# Altium project Y001_Artix7_USB3.0_D0.PrjPCB (part 1 of 2)
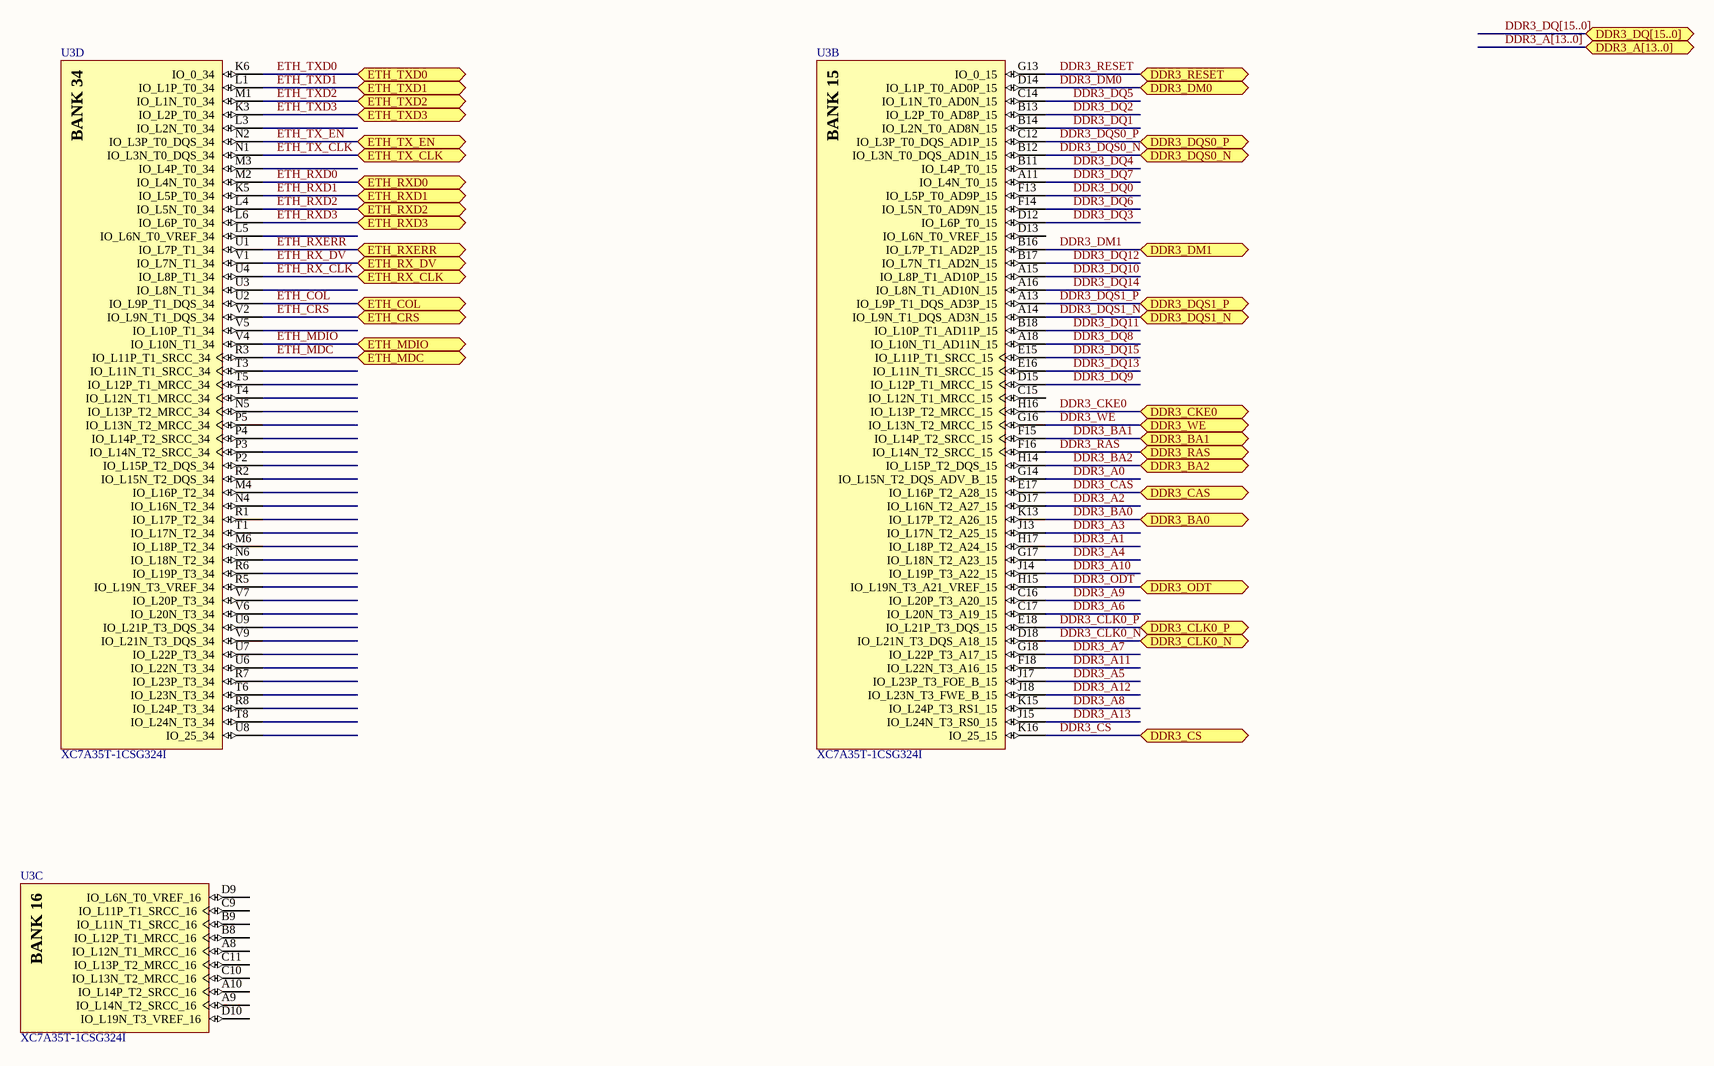
[diagram p0: FPGA_Bank_0.SchDoc]
9 sheets, 325 parts. Net scope: flat (ports and power ports of the same name join across sheets).
Board file: Y001_Artix7_USB3.0_D0.PcbDoc
Sheets:
  FPGA_Bank_0.SchDoc
  FPGA_Bank_1.SchDoc
  FPGA_Bank_2.SchDoc
  FPGA_Bank_3.SchDoc
  FPGA_10_100 Ethernet PHY.SchDoc
  DDR3.SchDoc
  USB3.0.SchDoc
  POWER.SchDoc
  POWER2.SchDoc

## Sheet FPGA_Bank_0.SchDoc
size A3

### Parts
U3  XC7A35T-1CSG324I  [CSG324]  (parts B,C,D of 9)

### Ports
DDR3_A[13..0], DDR3_BA0, DDR3_BA1, DDR3_BA2, DDR3_CAS, DDR3_CKE0, DDR3_CLK0_N, DDR3_CLK0_P, DDR3_CS, DDR3_DM0, DDR3_DM1, DDR3_DQ[15..0], DDR3_DQS0_N, DDR3_DQS0_P, DDR3_DQS1_N, DDR3_DQS1_P, DDR3_ODT, DDR3_RAS, DDR3_RESET, DDR3_WE, ETH_COL, ETH_CRS, ETH_MDC, ETH_MDIO, ETH_RX_CLK, ETH_RX_DV, ETH_RXD0, ETH_RXD1, ETH_RXD2, ETH_RXD3, ETH_RXERR, ETH_TX_CLK, ETH_TX_EN, ETH_TXD0, ETH_TXD1, ETH_TXD2, ETH_TXD3

### Nets
DDR3_A0: U3.G14(IO_L15N_T2_DQS_ADV_B_15)
DDR3_A1: U3.H17(IO_L18P_T2_A24_15)
DDR3_A2: U3.D17(IO_L16N_T2_A27_15)
DDR3_A3: U3.J13(IO_L17N_T2_A25_15)
DDR3_A4: U3.G17(IO_L18N_T2_A23_15)
DDR3_A5: U3.J17(IO_L23P_T3_FOE_B_15)
DDR3_A6: U3.C17(IO_L20N_T3_A19_15)
DDR3_A7: U3.G18(IO_L22P_T3_A17_15)
DDR3_A8: U3.K15(IO_L24P_T3_RS1_15)
DDR3_A9: U3.C16(IO_L20P_T3_A20_15)
DDR3_A10: U3.J14(IO_L19P_T3_A22_15)
DDR3_A11: U3.F18(IO_L22N_T3_A16_15)
DDR3_A12: U3.J18(IO_L23N_T3_FWE_B_15)
DDR3_A13: U3.J15(IO_L24N_T3_RS0_15)
DDR3_BA0: U3.K13(IO_L17P_T2_A26_15) ; port DDR3_BA0
DDR3_BA1: U3.F15(IO_L14P_T2_SRCC_15) ; port DDR3_BA1
DDR3_BA2: U3.H14(IO_L15P_T2_DQS_15) ; port DDR3_BA2
DDR3_CAS: U3.E17(IO_L16P_T2_A28_15) ; port DDR3_CAS
DDR3_CKE0: U3.H16(IO_L13P_T2_MRCC_15) ; port DDR3_CKE0
DDR3_CLK0_N: U3.D18(IO_L21N_T3_DQS_A18_15) ; port DDR3_CLK0_N
DDR3_CLK0_P: U3.E18(IO_L21P_T3_DQS_15) ; port DDR3_CLK0_P
DDR3_CS: U3.K16(IO_25_15) ; port DDR3_CS
DDR3_DM0: U3.D14(IO_L1P_T0_AD0P_15) ; port DDR3_DM0
DDR3_DM1: U3.B16(IO_L7P_T1_AD2P_15) ; port DDR3_DM1
DDR3_DQ0: U3.F13(IO_L5P_T0_AD9P_15)
DDR3_DQ1: U3.B14(IO_L2N_T0_AD8N_15)
DDR3_DQ2: U3.B13(IO_L2P_T0_AD8P_15)
DDR3_DQ3: U3.D12(IO_L6P_T0_15)
DDR3_DQ4: U3.B11(IO_L4P_T0_15)
DDR3_DQ5: U3.C14(IO_L1N_T0_AD0N_15)
DDR3_DQ6: U3.F14(IO_L5N_T0_AD9N_15)
DDR3_DQ7: U3.A11(IO_L4N_T0_15)
DDR3_DQ8: U3.A18(IO_L10N_T1_AD11N_15)
DDR3_DQ9: U3.D15(IO_L12P_T1_MRCC_15)
DDR3_DQ10: U3.A15(IO_L8P_T1_AD10P_15)
DDR3_DQ11: U3.B18(IO_L10P_T1_AD11P_15)
DDR3_DQ12: U3.B17(IO_L7N_T1_AD2N_15)
DDR3_DQ13: U3.E16(IO_L11N_T1_SRCC_15)
DDR3_DQ14: U3.A16(IO_L8N_T1_AD10N_15)
DDR3_DQ15: U3.E15(IO_L11P_T1_SRCC_15)
DDR3_DQS0_N: U3.B12(IO_L3N_T0_DQS_AD1N_15) ; port DDR3_DQS0_N
DDR3_DQS0_P: U3.C12(IO_L3P_T0_DQS_AD1P_15) ; port DDR3_DQS0_P
DDR3_DQS1_N: U3.A14(IO_L9N_T1_DQS_AD3N_15) ; port DDR3_DQS1_N
DDR3_DQS1_P: U3.A13(IO_L9P_T1_DQS_AD3P_15) ; port DDR3_DQS1_P
DDR3_ODT: U3.H15(IO_L19N_T3_A21_VREF_15) ; port DDR3_ODT
DDR3_RAS: U3.F16(IO_L14N_T2_SRCC_15) ; port DDR3_RAS
DDR3_RESET: U3.G13(IO_0_15) ; port DDR3_RESET
DDR3_WE: U3.G16(IO_L13N_T2_MRCC_15) ; port DDR3_WE
ETH_COL: U3.U2(IO_L9P_T1_DQS_34) ; port ETH_COL
ETH_CRS: U3.V2(IO_L9N_T1_DQS_34) ; port ETH_CRS
ETH_MDC: U3.R3(IO_L11P_T1_SRCC_34) ; port ETH_MDC
ETH_MDIO: U3.V4(IO_L10N_T1_34) ; port ETH_MDIO
ETH_RX_CLK: U3.U4(IO_L8P_T1_34) ; port ETH_RX_CLK
ETH_RX_DV: U3.V1(IO_L7N_T1_34) ; port ETH_RX_DV
ETH_RXD0: U3.M2(IO_L4N_T0_34) ; port ETH_RXD0
ETH_RXD1: U3.K5(IO_L5P_T0_34) ; port ETH_RXD1
ETH_RXD2: U3.L4(IO_L5N_T0_34) ; port ETH_RXD2
ETH_RXD3: U3.L6(IO_L6P_T0_34) ; port ETH_RXD3
ETH_RXERR: U3.U1(IO_L7P_T1_34) ; port ETH_RXERR
ETH_TX_CLK: U3.N1(IO_L3N_T0_DQS_34) ; port ETH_TX_CLK
ETH_TX_EN: U3.N2(IO_L3P_T0_DQS_34) ; port ETH_TX_EN
ETH_TXD0: U3.K6(IO_0_34) ; port ETH_TXD0
ETH_TXD1: U3.L1(IO_L1P_T0_34) ; port ETH_TXD1
ETH_TXD2: U3.M1(IO_L1N_T0_34) ; port ETH_TXD2
ETH_TXD3: U3.K3(IO_L2P_T0_34) ; port ETH_TXD3

Not connected (* = marked no-connect by the designer): U3 A8(IO_L12N_T1_MRCC_16) A9(IO_L14N_T2_SRCC_16) A10(IO_L14P_T2_SRCC_16) B8(IO_L12P_T1_MRCC_16) B9(IO_L11N_T1_SRCC_16) C9(IO_L11P_T1_SRCC_16) C10(IO_L13N_T2_MRCC_16) C11(IO_L13P_T2_MRCC_16) C15(IO_L12N_T1_MRCC_15) D9(IO_L6N_T0_VREF_16) D10(IO_L19N_T3_VREF_16) D13(IO_L6N_T0_VREF_15) L3(IO_L2N_T0_34) L5(IO_L6N_T0_VREF_34) M3(IO_L4P_T0_34) M4(IO_L16P_T2_34) M6(IO_L18P_T2_34) N4(IO_L16N_T2_34) N5(IO_L13P_T2_MRCC_34) N6(IO_L18N_T2_34) P2(IO_L15P_T2_DQS_34) P3(IO_L14N_T2_SRCC_34) P4(IO_L14P_T2_SRCC_34) P5(IO_L13N_T2_MRCC_34) R1(IO_L17P_T2_34) R2(IO_L15N_T2_DQS_34) R5(IO_L19N_T3_VREF_34) R6(IO_L19P_T3_34) R7(IO_L23P_T3_34) R8(IO_L24P_T3_34) T1(IO_L17N_T2_34) T3(IO_L11N_T1_SRCC_34) T4(IO_L12N_T1_MRCC_34) T5(IO_L12P_T1_MRCC_34) T6(IO_L23N_T3_34) T8(IO_L24N_T3_34) U3(IO_L8N_T1_34) U6(IO_L22N_T3_34) U7(IO_L22P_T3_34) U8(IO_25_34) U9(IO_L21P_T3_DQS_34) V5(IO_L10P_T1_34) V6(IO_L20N_T3_34) V7(IO_L20P_T3_34) V9(IO_L21N_T3_DQS_34)

### Buses and harness runs
bus DDR3_A[13..0] = port DDR3_A[13..0]
bus DDR3_DQ[15..0] = port DDR3_DQ[15..0]

### Notes on the sheet
- (in symbol XC7A35T-1CSG324I, part B) BANK 15
- (in symbol XC7A35T-1CSG324I, part C) BANK 16
- (in symbol XC7A35T-1CSG324I, part D) BANK 34

### Library data of the parts
U3 = XC7A35T-1CSG324I: Artix-7 FPGA, 210 User I/Os, 0 GTP, 324-Ball BGA, Speed Grade 1, Industrial Grade, Pb-Free; Manufacturer: Xilinx; Total Block RAM: 1800 Kb; GTP: 0; Clock Mgmt Tiles (CMTs): 5; Logic Cells: 33280; Available User I/O: 210; Speed Grades: 1; DatasheetVersion: v1.15; PackageVersion: Rev. 1.11; PackageReference: CSG-324; PackageDescription: 324-Ball Wire-Bond Chip-Scale BGA, Body 15 x 15 mm, Pitch 0.8 mm; Maximum Distributed RAM: 400 Kb; Operating Temperature Range: Industrial; NexusDeviceID: XC7A35T-1CSG324I; Mounting Technology: Surface Mount; PartNumber: XC7A35T-1CSG324I; ComponentLink1Description: Manufacturer URL; ComponentLink1URL: http://www.xilinx.com/; ComponentLink2Description: Datasheet; ComponentLink2URL: http://www.xilinx.com/support/documentation/data_sheets/ds180_7Series_Overview.pdf; ComponentLink3Description: Package Specification; ComponentLink3URL: http://www.xilinx.com/support/documentation/user_guides/ug475_7Series_Pkg_Pinout.pdf; ComponentLink4Description: DC and Switching Characteristics; ComponentLink4URL: http://www.xilinx.com/support/documentation/data_sheets/ds181_Artix_7_Data_Sheet.pdf; ComponentLink5Description: Package File; ComponentLink5URL: http://www.xilinx.com/support/packagefiles/a7packages/xc7a200tsbg484pkg.txt; ComponentLink6Description: Packaging and Pinout; ComponentLink6URL: http://www.xilinx.com/support/documentation/user_guides/ug475_7Series_Pkg_Pinout.pdf

## Sheet FPGA_Bank_1.SchDoc
size A3
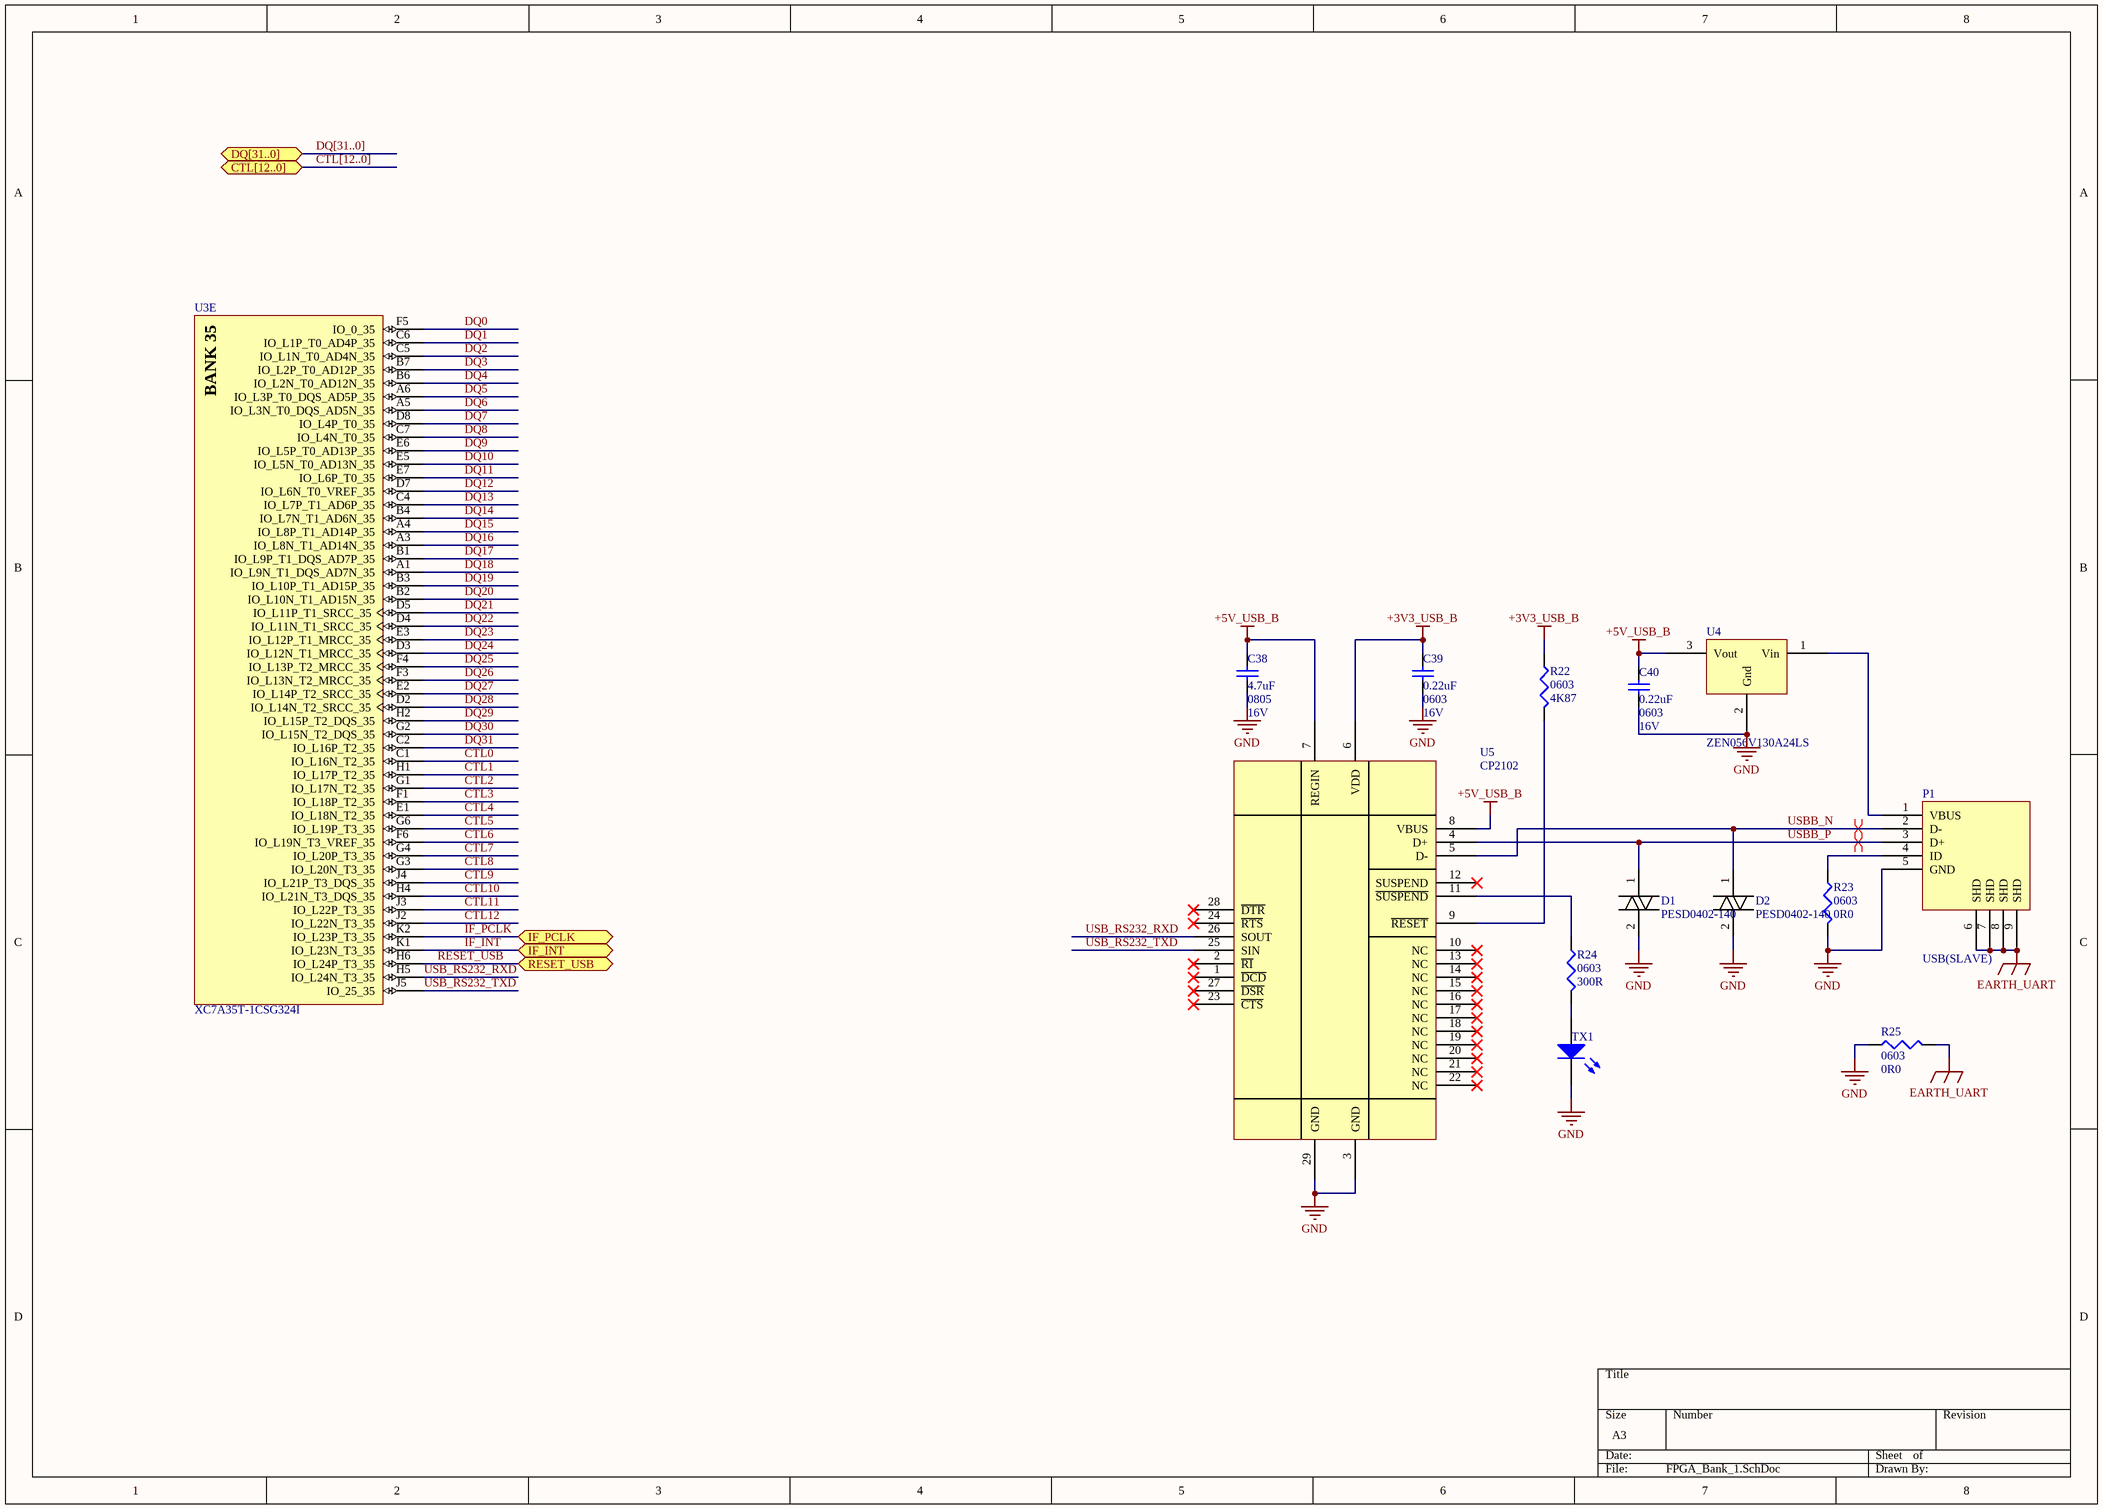
[diagram p1: FPGA_Bank_1.SchDoc]

### Parts
C38  PackageReference: 0805  V: 16V  [2012[0805]]  (hidden comment: 4.7uF)
C39  PackageReference: 0603  V: 16V  [1608[0603]]  (hidden comment: 0.22uF)
C40  PackageReference: 0603  V: 16V  [1608[0603]]  (hidden comment: 0.22uF)
D1  PESD0402-140  [PESD0402-140]
D2  PESD0402-140  [PESD0402-140]
P1  USB(SLAVE)  [USB_MINI_Btype]
R22  value 4K87  PackageReference: 0603  [1608[0603]]  (hidden comment: Res3)
R23  value 0R0  PackageReference: 0603  [1608[0603]]  (hidden comment: Res3)
R24  value 300R  PackageReference: 0603  [1608[0603]]  (hidden comment: Res3)
R25  value 0R0  PackageReference: 0603  [1608[0603]]  (hidden comment: Res3)
TX1  LINK  [0805LED]  (value not drawn)
U3  XC7A35T-1CSG324I  [CSG324]  (part E of 9)
U4  ZEN056V130A24LS  [ZEN056]
U5  CP2102  [CP2102[QFN28]]

### Ports
CTL[12..0], DQ[31..0], IF_INT, IF_PCLK, RESET_USB

### Nets
+3V3_USB_B: C39.1 R22.1 U5.6(VDD)
+5V_USB_B: C38.1 C40.1 U4.3(Vout) U5.7(REGIN) U5.8(VBUS)
EARTH_UART: P1.6(SHD) P1.7(SHD) P1.8(SHD) P1.9(SHD) R25.2
GND: C38.2 C39.2 C40.2 D1.2 D2.2 P1.5(GND) R23.2 R25.1 TX1.2(K) U4.2(Gnd) U5.3(GND) U5.29(GND)
CTL0: U3.C1(IO_L16N_T2_35)
CTL1: U3.H1(IO_L17P_T2_35)
CTL2: U3.G1(IO_L17N_T2_35)
CTL3: U3.F1(IO_L18P_T2_35)
CTL4: U3.E1(IO_L18N_T2_35)
CTL5: U3.G6(IO_L19P_T3_35)
CTL6: U3.F6(IO_L19N_T3_VREF_35)
CTL7: U3.G4(IO_L20P_T3_35)
CTL8: U3.G3(IO_L20N_T3_35)
CTL9: U3.J4(IO_L21P_T3_DQS_35)
CTL10: U3.H4(IO_L21N_T3_DQS_35)
CTL11: U3.J3(IO_L22P_T3_35)
CTL12: U3.J2(IO_L22N_T3_35)
DQ0: U3.F5(IO_0_35)
DQ1: U3.C6(IO_L1P_T0_AD4P_35)
DQ2: U3.C5(IO_L1N_T0_AD4N_35)
DQ3: U3.B7(IO_L2P_T0_AD12P_35)
DQ4: U3.B6(IO_L2N_T0_AD12N_35)
DQ5: U3.A6(IO_L3P_T0_DQS_AD5P_35)
DQ6: U3.A5(IO_L3N_T0_DQS_AD5N_35)
DQ7: U3.D8(IO_L4P_T0_35)
DQ8: U3.C7(IO_L4N_T0_35)
DQ9: U3.E6(IO_L5P_T0_AD13P_35)
DQ10: U3.E5(IO_L5N_T0_AD13N_35)
DQ11: U3.E7(IO_L6P_T0_35)
DQ12: U3.D7(IO_L6N_T0_VREF_35)
DQ13: U3.C4(IO_L7P_T1_AD6P_35)
DQ14: U3.B4(IO_L7N_T1_AD6N_35)
DQ15: U3.A4(IO_L8P_T1_AD14P_35)
DQ16: U3.A3(IO_L8N_T1_AD14N_35)
DQ17: U3.B1(IO_L9P_T1_DQS_AD7P_35)
DQ18: U3.A1(IO_L9N_T1_DQS_AD7N_35)
DQ19: U3.B3(IO_L10P_T1_AD15P_35)
DQ20: U3.B2(IO_L10N_T1_AD15N_35)
DQ21: U3.D5(IO_L11P_T1_SRCC_35)
DQ22: U3.D4(IO_L11N_T1_SRCC_35)
DQ23: U3.E3(IO_L12P_T1_MRCC_35)
DQ24: U3.D3(IO_L12N_T1_MRCC_35)
DQ25: U3.F4(IO_L13P_T2_MRCC_35)
DQ26: U3.F3(IO_L13N_T2_MRCC_35)
DQ27: U3.E2(IO_L14P_T2_SRCC_35)
DQ28: U3.D2(IO_L14N_T2_SRCC_35)
DQ29: U3.H2(IO_L15P_T2_DQS_35)
DQ30: U3.G2(IO_L15N_T2_DQS_35)
DQ31: U3.C2(IO_L16P_T2_35)
IF_INT: U3.K1(IO_L23N_T3_35) ; port IF_INT
IF_PCLK: U3.K2(IO_L23P_T3_35) ; port IF_PCLK
RESET_USB: U3.H6(IO_L24P_T3_35) ; port RESET_USB
USB_RS232_RXD: U3.H5(IO_L24N_T3_35) U5.26(SOUT)
USB_RS232_TXD: U3.J5(IO_25_35) U5.25(SIN)
USBB_N: D2.1 P1.2(D-) U5.5(D-)
USBB_P: D1.1 P1.3(D+) U5.4(D+)
NetP1_1: P1.1(VBUS) U4.1(Vin)
NetP1_4: P1.4(ID) R23.1
NetR22_2: R22.2 U5.9(~{RESET})
NetR24_1: R24.1 U5.11(~{SUSPEND})
NetR24_2: R24.2 TX1.1(A)

Not connected (* = marked no-connect by the designer): U5 1(~{DCD})* 2(~{RI})* 10(NC)* 12(SUSPEND)* 13(NC)* 14(NC)* 15(NC)* 16(NC)* 17(NC)* 18(NC)* 19(NC)* 20(NC)* 21(NC)* 22(NC)* 23(~{CTS})* 24(~{RTS})* 27(~{DSR})* 28(~{DTR})*

### Buses and harness runs
bus CTL[12..0] = port CTL[12..0]
bus DQ[31..0] = port DQ[31..0]

### Layout directives
differential pair: USBB_N, USBB_P

### Notes on the sheet
- (in symbol XC7A35T-1CSG324I, part E) BANK 35

### Library data of the parts
C38-C40 = Cap Semi: Capacitor (Semiconductor SIM Model); LatestRevisionDate: 17-Jul-2002; LatestRevisionNote: Re-released for DXP Platform.; Publisher: Altium Limited
  C38: Value: 4.7uF
  C39 C40: Value: 0.22uF
D1 D2 = PESD0402-140: ESD保护器件
P1 = USB(SLAVE): USB座
R22-R25 = Res3: Resistor; Published: 8-Jun-2000; LatestRevisionDate: 29-May-2009; LatestRevisionNote: IPC-7351 Footprint Added.; Publisher: Altium Limited; PackageDescription: Chip Resistor
TX1 = LED0: Typical INFRARED GaAs LED; Published: 8-Jun-2000; LatestRevisionDate: 08-Jul-2005; LatestRevisionNote: Mech Layer 1 removed.; PackageReference: LED-0; Publisher: Altium Limited
U3 = XC7A35T-1CSG324I: as U3 on sheet FPGA_Bank_0; DatasheetVersion: v1.15; PackageVersion: Rev. 1.11; PackageReference: CSG-324; PackageDescription: 324-Ball Wire-Bond Chip-Scale BGA, Body 15 x 15 mm, Pitch 0.8 mm; Maximum Distributed RAM: 400 Kb; Operating Temperature Range: Industrial; NexusDeviceID: XC7A35T-1CSG324I; Mounting Technology: Surface Mount; PartNumber: XC7A35T-1CSG324I; ComponentLink1Description: Manufacturer URL; ComponentLink1URL: http://www.xilinx.com/; ComponentLink2Description: Datasheet; ComponentLink2URL: http://www.xilinx.com/support/documentation/data_sheets/ds180_7Series_Overview.pdf; ComponentLink3Description: Package Specification; ComponentLink3URL: http://www.xilinx.com/support/documentation/user_guides/ug475_7Series_Pkg_Pinout.pdf; ComponentLink4Description: DC and Switching Characteristics; ComponentLink4URL: http://www.xilinx.com/support/documentation/data_sheets/ds181_Artix_7_Data_Sheet.pdf; ComponentLink5Description: Package File; ComponentLink5URL: http://www.xilinx.com/support/packagefiles/a7packages/xc7a200tsbg484pkg.txt; ComponentLink6Description: Packaging and Pinout; ComponentLink6URL: http://www.xilinx.com/support/documentation/user_guides/ug475_7Series_Pkg_Pinout.pdf
U4 = ZEN056V130A24LS: 电压瞬态抑制器
U5 = CP2102: Single Chip USB to UART Bridge; MANF: Silicon Labs; FootPrint: CP2102[QFN-28]; Preferred Part Number: CP2102; Value: CP2102

## Sheet FPGA_Bank_2.SchDoc
size A3
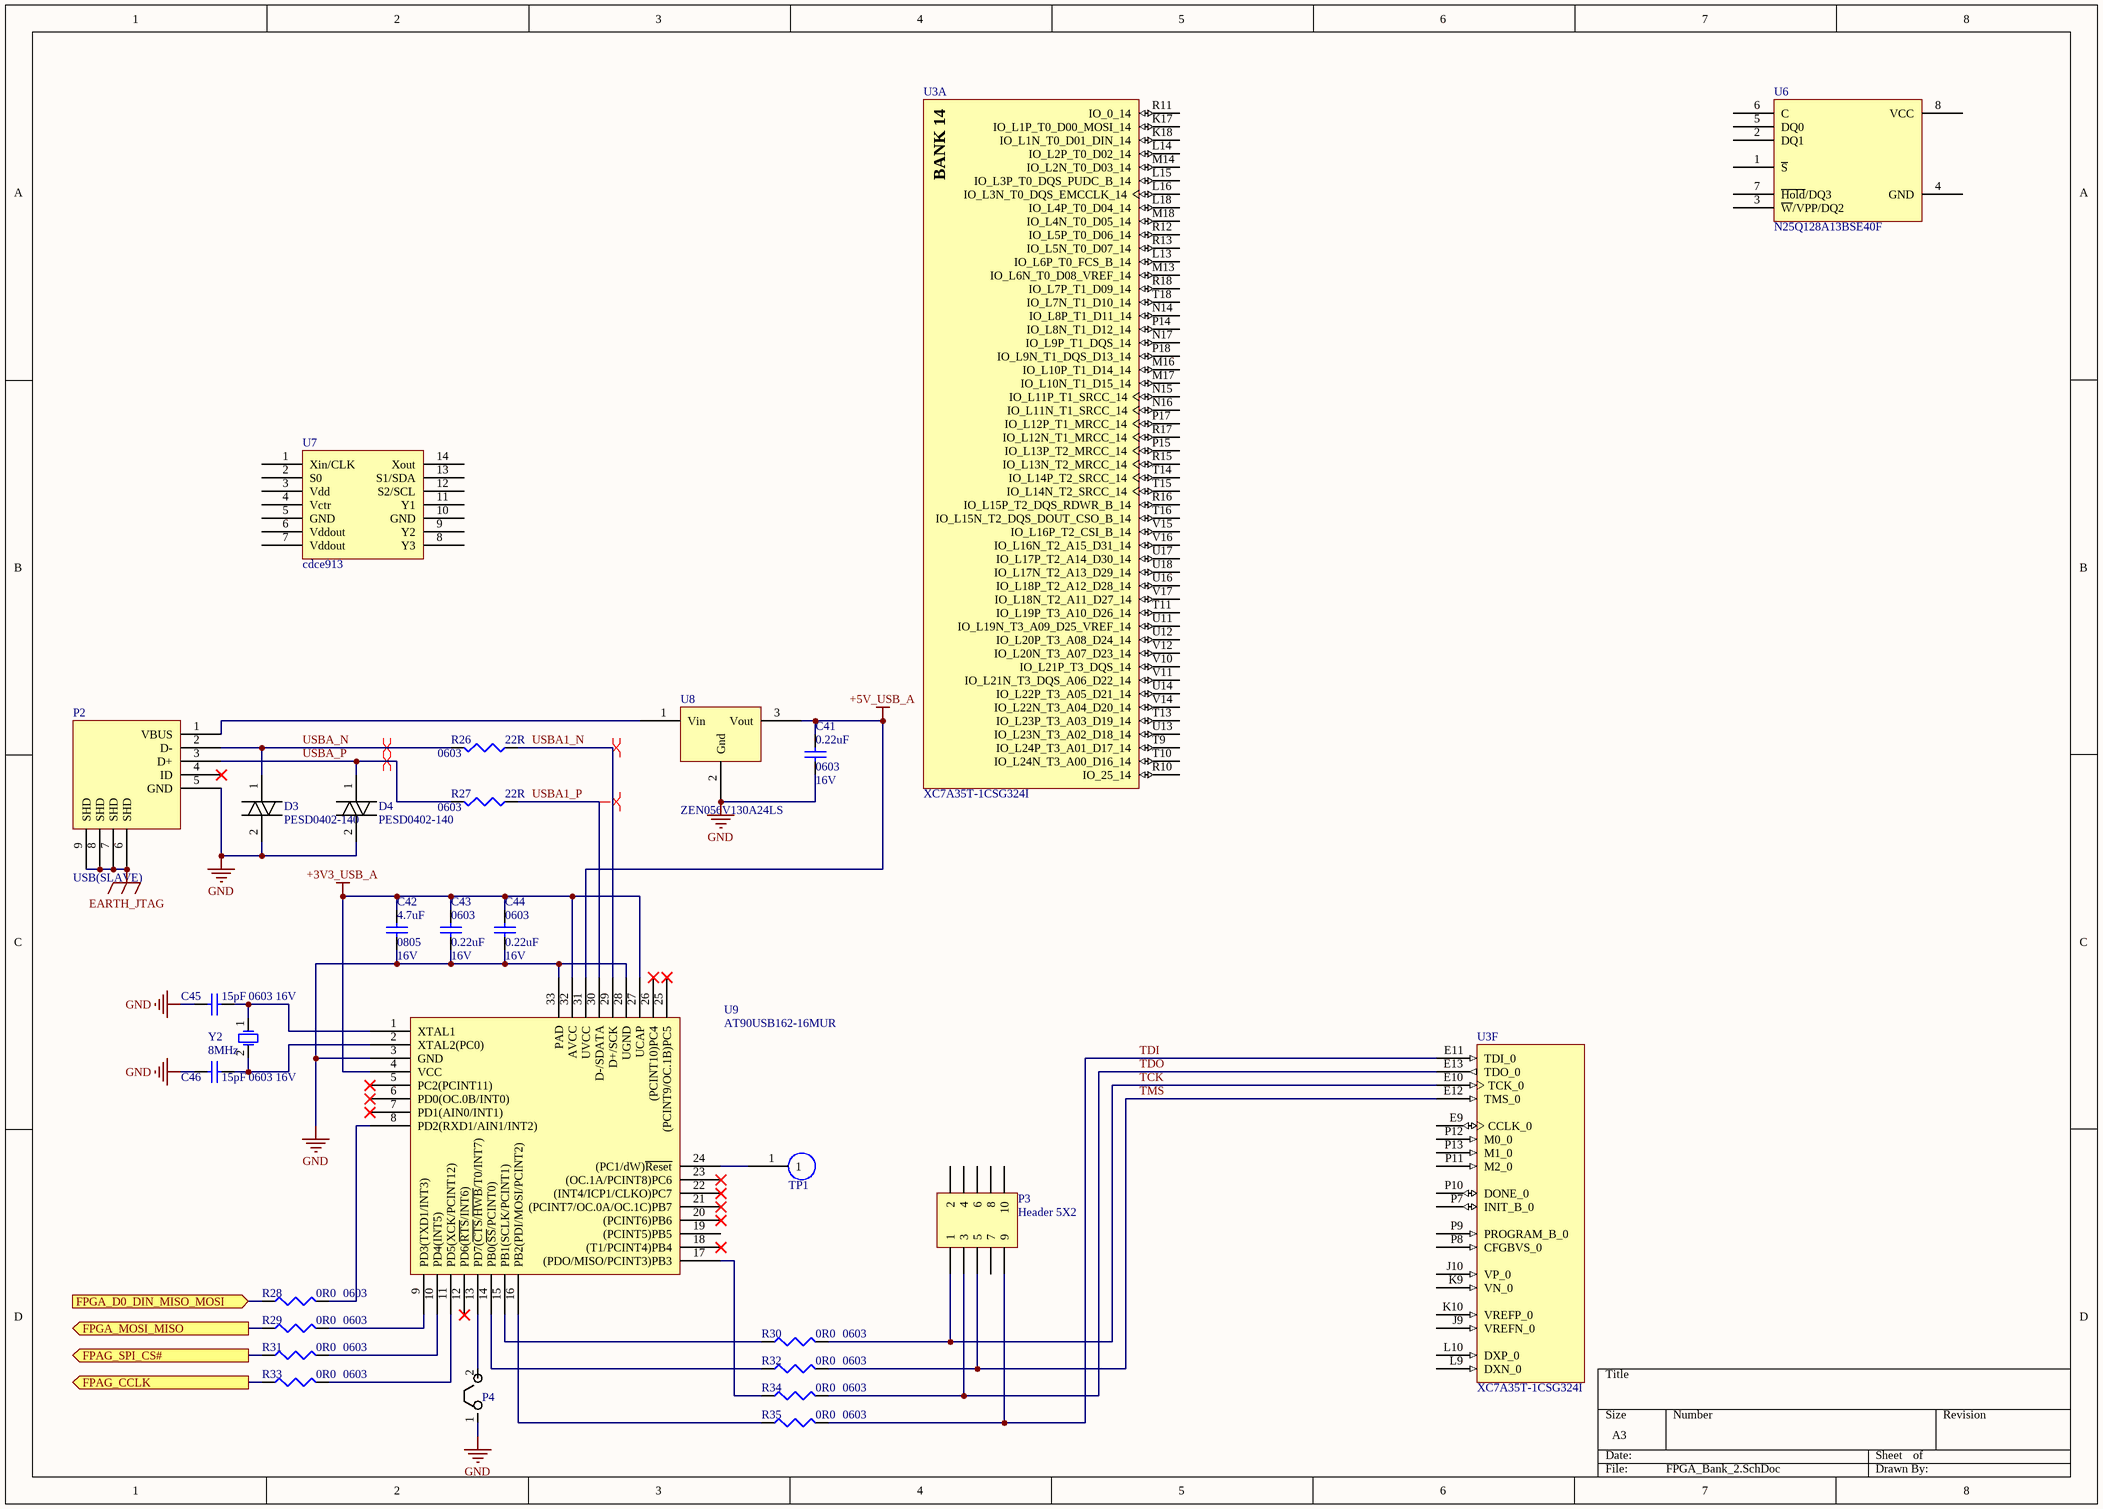
[diagram p2: FPGA_Bank_2.SchDoc]

### Parts
C41  PackageReference: 0603  V: 16V  [1608[0603]]  (hidden comment: 0.22uF)
C42  PackageReference: 0805  V: 16V  [2012[0805]]  (hidden comment: 4.7uF)
C43  PackageReference: 0603  V: 16V  [1608[0603]]  (hidden comment: 0.22uF)
C44  PackageReference: 0603  V: 16V  [1608[0603]]  (hidden comment: 0.22uF)
C45  PackageReference: 0603  V: 16V  [1608[0603]]  (hidden comment: 15pF)
C46  PackageReference: 0603  V: 16V  [1608[0603]]  (hidden comment: 15pF)
D3  PESD0402-140  [PESD0402-140]
D4  PESD0402-140  [PESD0402-140]
P2  USB(SLAVE)  [USB_MINI_Btype]
P3  Header 5X2  [HDR2X5]
P4  DNP  [DNP]  (value not drawn)
R26  value 22R  PackageReference: 0603  [1608[0603]]  (hidden comment: Res3)
R27  value 22R  PackageReference: 0603  [1608[0603]]  (hidden comment: Res3)
R28  value 0R0  PackageReference: 0603  [1608[0603]]  (hidden comment: Res3)
R29  value 0R0  PackageReference: 0603  [1608[0603]]  (hidden comment: Res3)
R30  value 0R0  PackageReference: 0603  [1608[0603]]  (hidden comment: Res3)
R31  value 0R0  PackageReference: 0603  [1608[0603]]  (hidden comment: Res3)
R32  value 0R0  PackageReference: 0603  [1608[0603]]  (hidden comment: Res3)
R33  value 0R0  PackageReference: 0603  [1608[0603]]  (hidden comment: Res3)
R34  value 0R0  PackageReference: 0603  [1608[0603]]  (hidden comment: Res3)
R35  value 0R0  PackageReference: 0603  [1608[0603]]  (hidden comment: Res3)
TP1  TP  (value not drawn)
U3  XC7A35T-1CSG324I  [CSG324]  (parts A,F of 9)
U6  N25Q128A13BSE40F  [N25Q128A13BSE40F[SOP-8]]
U7  cdce913  [CDCE913[TSSOP-14]]
U8  ZEN056V130A24LS  [ZEN056]
U9  AT90USB162-16MUR  [AT90USB162-16MUR]
Y2  8MHz  [XTAL_A]

### Ports
FPAG_CCLK (out), FPAG_SPI_CS# (out), FPGA_D0_DIN_MISO_MOSI (in), FPGA_MOSI_MISO (out)

### Nets
+3V3_USB_A: C42.1 C43.1 C44.1 U9.4(VCC) U9.27(UCAP) U9.32(AVCC)
+5V_USB_A: C41.1 U8.3(Vout) U9.31(UVCC)
EARTH_JTAG: P2.6(SHD) P2.7(SHD) P2.8(SHD) P2.9(SHD)
GND: C41.2 C42.2 C43.2 C44.2 C45.2 C46.2 D3.2 D4.2 P2.5(GND) P4.1 U8.2(Gnd) U9.3(GND) U9.28(UGND) U9.33(PAD)
TCK: P3.1 R30.2 U3.E10(TCK_0)
TDI: P3.9 R35.2 U3.E11(TDI_0)
TDO: P3.3 R34.2 U3.E13(TDO_0)
TMS: P3.5 R32.2 U3.E12(TMS_0)
USBA1_N: R26.1 U9.29(D+/SCK)
USBA1_P: R27.1 U9.30(D-/SDATA)
USBA_N: D3.1 P2.2(D-) R26.2
USBA_P: D4.1 P2.3(D+) R27.2
NetC45_1: C45.1 U9.1(XTAL1) Y2.1(OSC1)
NetC46_1: C46.1 U9.2(XTAL2(PC0)) Y2.2(OSC2)
NetP2_1: P2.1(VBUS) U8.1(Vin)
NetP4_2: P4.2 U9.13(PD7(~{CTS}/~{HWB}/T0/INT7))
NetR28_1: R28.1 ; port FPGA_D0_DIN_MISO_MOSI
NetR28_2: R28.2 U9.8(PD2(RXD1/AIN1/INT2))
NetR29_1: R29.1 ; port FPGA_MOSI_MISO
NetR29_2: R29.2 U9.9(PD3(TXD1/INT3))
NetR30_1: R30.1 U9.15(PB1(SCLK/PCINT1))
NetR31_1: R31.1 ; port FPAG_SPI_CS#
NetR31_2: R31.2 U9.10(PD4(INT5))
NetR32_1: R32.1 U9.14(PB0(~{SS}/PCINT0))
NetR33_1: R33.1 ; port FPAG_CCLK
NetR33_2: R33.2 U9.11(PD5(XCK/PCINT12))
NetR34_1: R34.1 U9.17((PDO/MISO/PCINT3)PB3)
NetR35_1: R35.1 U9.16(PB2(PDI/MOSI/PCINT2))
NetTP1_1: TP1.1 U9.24((PC1/dW)~{Reset})

Not connected (* = marked no-connect by the designer): P2 4(ID)*; P3 2 4 6 7 8 10; U3 E9(CCLK_0) J9(VREFN_0) J10(VP_0) K9(VN_0) K10(VREFP_0) K17(IO_L1P_T0_D00_MOSI_14) K18(IO_L1N_T0_D01_DIN_14) L9(DXN_0) L10(DXP_0) L13(IO_L6P_T0_FCS_B_14) L14(IO_L2P_T0_D02_14) L15(IO_L3P_T0_DQS_PUDC_B_14) L16(IO_L3N_T0_DQS_EMCCLK_14) L18(IO_L4P_T0_D04_14) M13(IO_L6N_T0_D08_VREF_14) M14(IO_L2N_T0_D03_14) M16(IO_L10P_T1_D14_14) M17(IO_L10N_T1_D15_14) M18(IO_L4N_T0_D05_14) N14(IO_L8P_T1_D11_14) N15(IO_L11P_T1_SRCC_14) N16(IO_L11N_T1_SRCC_14) N17(IO_L9P_T1_DQS_14) P7(INIT_B_0) P8(CFGBVS_0) P9(PROGRAM_B_0) P10(DONE_0) P11(M2_0) P12(M0_0) P13(M1_0) P14(IO_L8N_T1_D12_14) P15(IO_L13P_T2_MRCC_14) P17(IO_L12P_T1_MRCC_14) P18(IO_L9N_T1_DQS_D13_14) R10(IO_25_14) R11(IO_0_14) R12(IO_L5P_T0_D06_14) R13(IO_L5N_T0_D07_14) R15(IO_L13N_T2_MRCC_14) R16(IO_L15P_T2_DQS_RDWR_B_14) R17(IO_L12N_T1_MRCC_14) R18(IO_L7P_T1_D09_14) T9(IO_L24P_T3_A01_D17_14) T10(IO_L24N_T3_A00_D16_14) T11(IO_L19P_T3_A10_D26_14) T13(IO_L23P_T3_A03_D19_14) T14(IO_L14P_T2_SRCC_14) T15(IO_L14N_T2_SRCC_14) T16(IO_L15N_T2_DQS_DOUT_CSO_B_14) T18(IO_L7N_T1_D10_14) U11(IO_L19N_T3_A09_D25_VREF_14) U12(IO_L20P_T3_A08_D24_14) U13(IO_L23N_T3_A02_D18_14) U14(IO_L22P_T3_A05_D21_14) U16(IO_L18P_T2_A12_D28_14) U17(IO_L17P_T2_A14_D30_14) U18(IO_L17N_T2_A13_D29_14) V10(IO_L21P_T3_DQS_14) V11(IO_L21N_T3_DQS_A06_D22_14) V12(IO_L20N_T3_A07_D23_14) V14(IO_L22N_T3_A04_D20_14) V15(IO_L16P_T2_CSI_B_14) V16(IO_L16N_T2_A15_D31_14) V17(IO_L18N_T2_A11_D27_14); U6 1(~{S}) 2(DQ1) 3(~{W}/VPP/DQ2) 4(GND) 5(DQ0) 6(C) 7(~{Hold}/DQ3) 8(VCC); U7 1(Xin/CLK) 2(S0) 3(Vdd) 4(Vctr) 5(GND) 6(Vddout) 7(Vddout) 8(Y3) 9(Y2) 10(GND) 11(Y1) 12(S2/SCL) 13(S1/SDA) 14(Xout); U9 5(PC2(PCINT11))* 6(PD0(OC.0B/INT0))* 7(PD1(AIN0/INT1))* 12(PD6(~{RTS}/INT6))* 18((T1/PCINT4)PB4)* 19((PCINT5)PB5) 20((PCINT6)PB6)* 21((PCINT7/OC.0A/OC.1C)PB7)* 22((INT4/ICP1/CLKO)PC7)* 23((OC.1A/PCINT8)PC6)* 25((PCINT9/OC.1B)PC5)* 26((PCINT10)PC4)*

### Layout directives
differential pair: USBA1_N, USBA1_P, USBA_N, USBA_P

### Notes on the sheet
- (in symbol XC7A35T-1CSG324I, part A) BANK 14

### Library data of the parts
C41-C46 = Cap Semi: Capacitor (Semiconductor SIM Model); LatestRevisionDate: 17-Jul-2002; LatestRevisionNote: Re-released for DXP Platform.; Publisher: Altium Limited
  C41 C43 C44: Value: 0.22uF
  C42: Value: 4.7uF
  C45 C46: Value: 15pF
D3 D4 = PESD0402-140: ESD保护器件
P2 = USB(SLAVE): USB座
P3 = Header 5X2: Header, 5-Pin, Dual row; LatestRevisionDate: 17-Jul-2002; LatestRevisionNote: Re-released for DXP Platform.; Publisher: Altium Limited
R26-R35 = Res3: Resistor; Published: 8-Jun-2000; LatestRevisionDate: 29-May-2009; LatestRevisionNote: IPC-7351 Footprint Added.; Publisher: Altium Limited; PackageDescription: Chip Resistor
U3 = XC7A35T-1CSG324I: as U3 on sheet FPGA_Bank_0; DatasheetVersion: v1.15; PackageVersion: Rev. 1.11; PackageReference: CSG-324; PackageDescription: 324-Ball Wire-Bond Chip-Scale BGA, Body 15 x 15 mm, Pitch 0.8 mm; Maximum Distributed RAM: 400 Kb; Operating Temperature Range: Industrial; NexusDeviceID: XC7A35T-1CSG324I; Mounting Technology: Surface Mount; PartNumber: XC7A35T-1CSG324I; ComponentLink1Description: Manufacturer URL; ComponentLink1URL: http://www.xilinx.com/; ComponentLink2Description: Datasheet; ComponentLink2URL: http://www.xilinx.com/support/documentation/data_sheets/ds180_7Series_Overview.pdf; ComponentLink3Description: Package Specification; ComponentLink3URL: http://www.xilinx.com/support/documentation/user_guides/ug475_7Series_Pkg_Pinout.pdf; ComponentLink4Description: DC and Switching Characteristics; ComponentLink4URL: http://www.xilinx.com/support/documentation/data_sheets/ds181_Artix_7_Data_Sheet.pdf; ComponentLink5Description: Package File; ComponentLink5URL: http://www.xilinx.com/support/packagefiles/a7packages/xc7a200tsbg484pkg.txt; ComponentLink6Description: Packaging and Pinout; ComponentLink6URL: http://www.xilinx.com/support/documentation/user_guides/ug475_7Series_Pkg_Pinout.pdf
U6 = N25Q128A13BSE40F: 128Mb, 3V, Multiple I/O Serial Flash Memory; MANF: Micron; Preferred Part Number: N25Q128A13BSE40F; Value: N25Q128A13BSE40F
U7 = cdce913: Flexible Low Power LVCMOS Clock Generator With SSC Support for EMI Reduction; MANF: TI; Preferred Part Number: cdce913; Value: cdce913
U8 = ZEN056V130A24LS: 电压瞬态抑制器
Y2 = XTAL: Crystal Oscillator; Published: 8-Jun-2000; LatestRevisionDate: 17-Jul-2002; LatestRevisionNote: Re-released for DXP Platform.; PackageReference: R38; Publisher: Altium Limited; Value: 8MHz

## Sheet FPGA_Bank_3.SchDoc
size A4
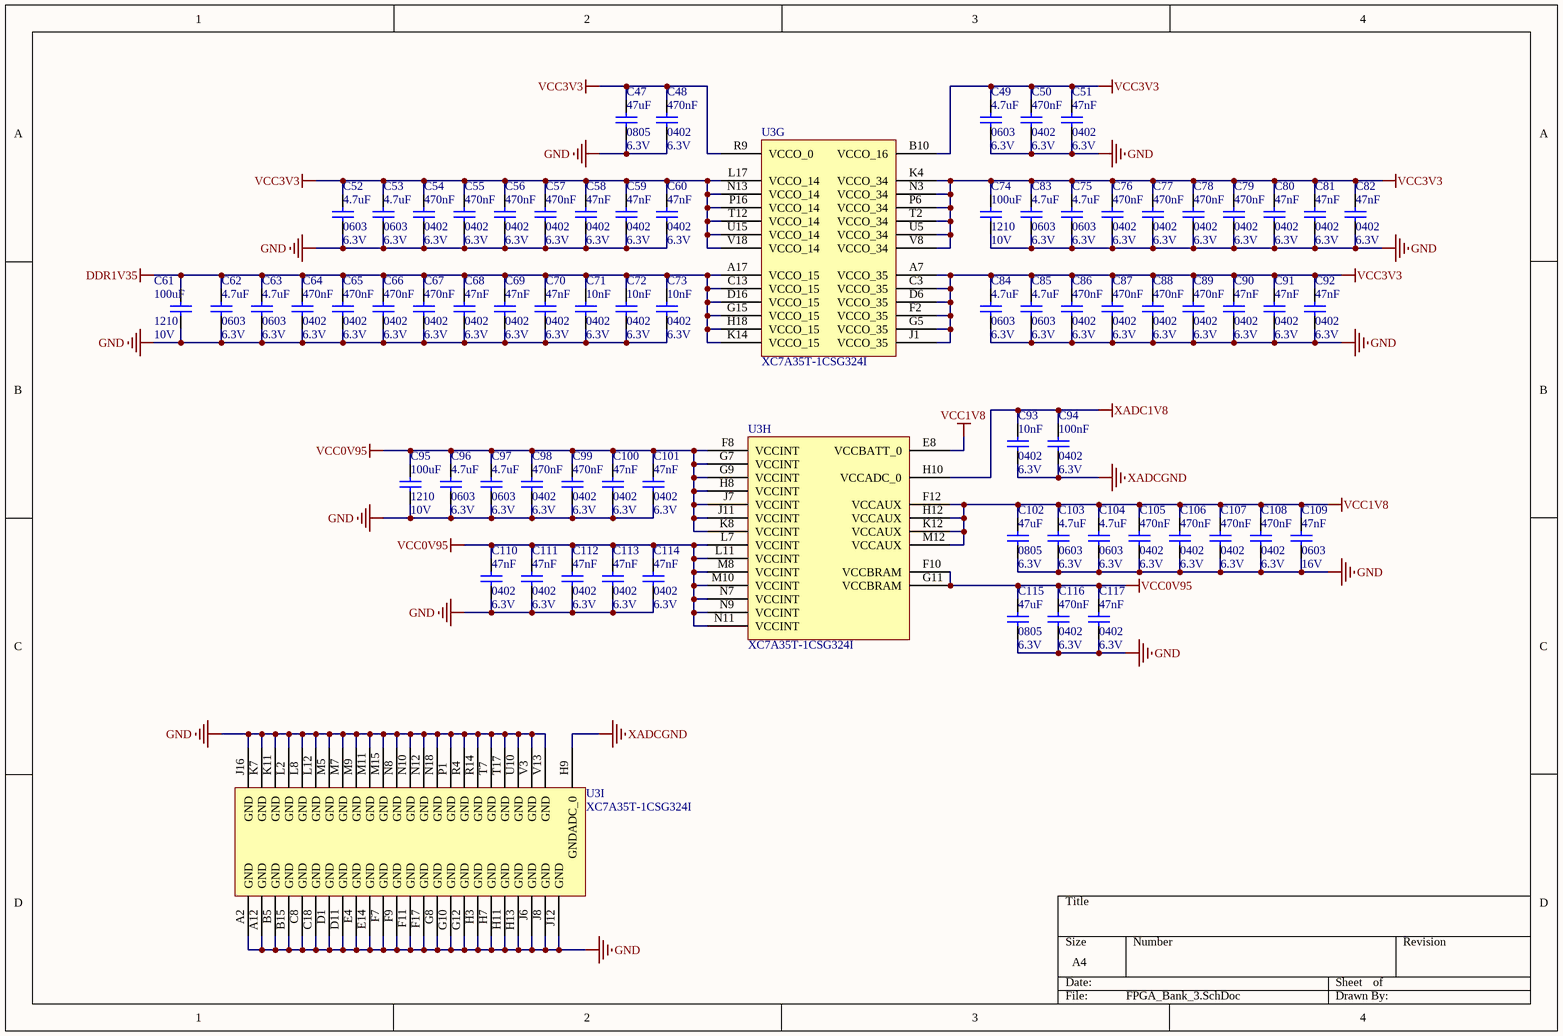
[diagram p3: FPGA_Bank_3.SchDoc]

### Parts
C47  PackageReference: 0805  V: 6.3V  [2012[0805]]  (hidden comment: 47uF)
C48  V: 6.3V  [0402]  (hidden comment: 470nF)
C49  PackageReference: 0603  V: 6.3V  [1608[0603]]  (hidden comment: 4.7uF)
C50  V: 6.3V  [0402]  (hidden comment: 470nF)
C51  V: 6.3V  [0402]  (hidden comment: 47nF)
C52  PackageReference: 0603  V: 6.3V  [1608[0603]]  (hidden comment: 4.7uF)
C53  PackageReference: 0603  V: 6.3V  [1608[0603]]  (hidden comment: 4.7uF)
C54  V: 6.3V  [0402]  (hidden comment: 470nF)
C55  V: 6.3V  [0402]  (hidden comment: 470nF)
C56  V: 6.3V  [0402]  (hidden comment: 470nF)
C57  V: 6.3V  [0402]  (hidden comment: 470nF)
C58  V: 6.3V  [0402]  (hidden comment: 47nF)
C59  V: 6.3V  [0402]  (hidden comment: 47nF)
C60  V: 6.3V  [0402]  (hidden comment: 47nF)
C61  PackageReference: 1210  V: 10V  [2012[0805]]  (hidden comment: 100uF)
C62  PackageReference: 0603  V: 6.3V  [1608[0603]]  (hidden comment: 4.7uF)
C63  PackageReference: 0603  V: 6.3V  [1608[0603]]  (hidden comment: 4.7uF)
C64  V: 6.3V  [0402]  (hidden comment: 470nF)
C65  V: 6.3V  [0402]  (hidden comment: 470nF)
C66  V: 6.3V  [0402]  (hidden comment: 470nF)
C67  V: 6.3V  [0402]  (hidden comment: 470nF)
C68  V: 6.3V  [0402]  (hidden comment: 47nF)
C69  V: 6.3V  [0402]  (hidden comment: 47nF)
C70  V: 6.3V  [0402]  (hidden comment: 47nF)
C71  V: 6.3V  [0402]  (hidden comment: 10nF)
C72  V: 6.3V  [0402]  (hidden comment: 10nF)
C73  V: 6.3V  [0402]  (hidden comment: 10nF)
C74  PackageReference: 1210  V: 10V  [2012[0805]]  (hidden comment: 100uF)
C75  PackageReference: 0603  V: 6.3V  [1608[0603]]  (hidden comment: 4.7uF)
C76  V: 6.3V  [0402]  (hidden comment: 470nF)
C77  V: 6.3V  [0402]  (hidden comment: 470nF)
C78  V: 6.3V  [0402]  (hidden comment: 470nF)
C79  V: 6.3V  [0402]  (hidden comment: 470nF)
C80  V: 6.3V  [0402]  (hidden comment: 47nF)
C81  V: 6.3V  [0402]  (hidden comment: 47nF)
C82  V: 6.3V  [0402]  (hidden comment: 47nF)
C83  PackageReference: 0603  V: 6.3V  [1608[0603]]  (hidden comment: 4.7uF)
C84  PackageReference: 0603  V: 6.3V  [1608[0603]]  (hidden comment: 4.7uF)
C85  PackageReference: 0603  V: 6.3V  [1608[0603]]  (hidden comment: 4.7uF)
C86  V: 6.3V  [0402]  (hidden comment: 470nF)
C87  V: 6.3V  [0402]  (hidden comment: 470nF)
C88  V: 6.3V  [0402]  (hidden comment: 470nF)
C89  V: 6.3V  [0402]  (hidden comment: 470nF)
C90  V: 6.3V  [0402]  (hidden comment: 47nF)
C91  V: 6.3V  [0402]  (hidden comment: 47nF)
C92  V: 6.3V  [0402]  (hidden comment: 47nF)
C93  V: 6.3V  [0402]  (hidden comment: 10nF)
C94  V: 6.3V  [0402]  (hidden comment: 100nF)
C95  PackageReference: 1210  V: 10V  [2012[0805]]  (hidden comment: 100uF)
C96  PackageReference: 0603  V: 6.3V  [1608[0603]]  (hidden comment: 4.7uF)
C97  PackageReference: 0603  V: 6.3V  [1608[0603]]  (hidden comment: 4.7uF)
C98  V: 6.3V  [0402]  (hidden comment: 470nF)
C99  V: 6.3V  [0402]  (hidden comment: 470nF)
C100  V: 6.3V  [0402]  (hidden comment: 47nF)
C101  V: 6.3V  [0402]  (hidden comment: 47nF)
C102  PackageReference: 0805  V: 6.3V  [2012[0805]]  (hidden comment: 47uF)
C103  PackageReference: 0603  V: 6.3V  [1608[0603]]  (hidden comment: 4.7uF)
C104  PackageReference: 0603  V: 6.3V  [1608[0603]]  (hidden comment: 4.7uF)
C105  V: 6.3V  [0402]  (hidden comment: 470nF)
C106  V: 6.3V  [0402]  (hidden comment: 470nF)
C107  V: 6.3V  [0402]  (hidden comment: 470nF)
C108  V: 6.3V  [0402]  (hidden comment: 470nF)
C109  PackageReference: 0603  V: 16V  [1608[0603]]  (hidden comment: 47nF)
C110  V: 6.3V  [0402]  (hidden comment: 47nF)
C111  V: 6.3V  [0402]  (hidden comment: 47nF)
C112  V: 6.3V  [0402]  (hidden comment: 47nF)
C113  V: 6.3V  [0402]  (hidden comment: 47nF)
C114  V: 6.3V  [0402]  (hidden comment: 47nF)
C115  PackageReference: 0805  V: 6.3V  [2012[0805]]  (hidden comment: 47uF)
C116  V: 6.3V  [0402]  (hidden comment: 470nF)
C117  V: 6.3V  [0402]  (hidden comment: 47nF)
U3  XC7A35T-1CSG324I  [CSG324]  (parts G,H,I of 9)

### Nets
DDR1V35: C61.1 C62.1 C63.1 C64.1 C65.1 C66.1 C67.1 C68.1 C69.1 C70.1 C71.1 C72.1 C73.1 U3.A17(VCCO_15) U3.C13(VCCO_15) U3.D16(VCCO_15) U3.G15(VCCO_15) U3.H18(VCCO_15) U3.K14(VCCO_15)
GND: C47.2 C48.2 C49.2 C50.2 C51.2 C52.2 C53.2 C54.2 C55.2 C56.2 C57.2 C58.2 C59.2 C60.2 C61.2 C62.2 C63.2 C64.2 C65.2 C66.2 C67.2 C68.2 C69.2 C70.2 C71.2 C72.2 C73.2 C74.2 C75.2 C76.2 C77.2 C78.2 C79.2 C80.2 C81.2 C82.2 C83.2 C84.2 C85.2 C86.2 C87.2 C88.2 C89.2 C90.2 C91.2 C92.2 C95.2 C96.2 C97.2 C98.2 C99.2 C100.2 C101.2 C102.2 C103.2 C104.2 C105.2 C106.2 C107.2 C108.2 C109.2 C110.2 C111.2 C112.2 C113.2 C114.2 C115.2 C116.2 C117.2 U3.A2(GND) U3.A12(GND) U3.B5(GND) U3.B15(GND) U3.C8(GND) U3.C18(GND) U3.D1(GND) U3.D11(GND) U3.E4(GND) U3.E14(GND) U3.F7(GND) U3.F9(GND) U3.F11(GND) U3.F17(GND) U3.G8(GND) U3.G10(GND) U3.G12(GND) U3.H3(GND) U3.H7(GND) U3.H11(GND) U3.H13(GND) U3.J6(GND) U3.J8(GND) U3.J12(GND) U3.J16(GND) U3.K7(GND) U3.K11(GND) U3.L2(GND) U3.L8(GND) U3.L12(GND) U3.M5(GND) U3.M7(GND) U3.M9(GND) U3.M11(GND) U3.M15(GND) U3.N8(GND) U3.N10(GND) U3.N12(GND) U3.N18(GND) U3.P1(GND) U3.R4(GND) U3.R14(GND) U3.T7(GND) U3.T17(GND) U3.U10(GND) U3.V3(GND) U3.V13(GND)
VCC0V95: C95.1 C96.1 C97.1 C98.1 C99.1 C100.1 C101.1 C110.1 C111.1 C112.1 C113.1 C114.1 C115.1 C116.1 C117.1 U3.F8(VCCINT) U3.F10(VCCBRAM) U3.G7(VCCINT) U3.G9(VCCINT) U3.G11(VCCBRAM) U3.H8(VCCINT) U3.J7(VCCINT) U3.J11(VCCINT) U3.K8(VCCINT) U3.L7(VCCINT) U3.L11(VCCINT) U3.M8(VCCINT) U3.M10(VCCINT) U3.N7(VCCINT) U3.N9(VCCINT) U3.N11(VCCINT)
VCC1V8: C102.1 C103.1 C104.1 C105.1 C106.1 C107.1 C108.1 C109.1 U3.E8(VCCBATT_0) U3.F12(VCCAUX) U3.H12(VCCAUX) U3.K12(VCCAUX) U3.M12(VCCAUX)
VCC3V3: C47.1 C48.1 C49.1 C50.1 C51.1 C52.1 C53.1 C54.1 C55.1 C56.1 C57.1 C58.1 C59.1 C60.1 C74.1 C75.1 C76.1 C77.1 C78.1 C79.1 C80.1 C81.1 C82.1 C83.1 C84.1 C85.1 C86.1 C87.1 C88.1 C89.1 C90.1 C91.1 C92.1 U3.A7(VCCO_35) U3.B10(VCCO_16) U3.C3(VCCO_35) U3.D6(VCCO_35) U3.F2(VCCO_35) U3.G5(VCCO_35) U3.J1(VCCO_35) U3.K4(VCCO_34) U3.L17(VCCO_14) U3.N3(VCCO_34) U3.N13(VCCO_14) U3.P6(VCCO_34) U3.P16(VCCO_14) U3.R9(VCCO_0) U3.T2(VCCO_34) U3.T12(VCCO_14) U3.U5(VCCO_34) U3.U15(VCCO_14) U3.V8(VCCO_34) U3.V18(VCCO_14)
XADC1V8: C93.1 C94.1 U3.H10(VCCADC_0)
XADCGND: C93.2 C94.2 U3.H9(GNDADC_0)

### Library data of the parts
C47-C117 = Cap Semi: Capacitor (Semiconductor SIM Model); LatestRevisionDate: 17-Jul-2002; LatestRevisionNote: Re-released for DXP Platform.; Publisher: Altium Limited
  C47 C102 C115: Value: 47uF
  C48 C50 C54-C57 C64-C67 C76-C79 C86-C89 C98 C99 C105-C108 C116: PackageReference: 0402; Value: 470nF
  C49 C52 C53 C62 C63 C75 C83-C85 C96 C97 C103 C104: Value: 4.7uF
  C51 C58-C60 C68-C70 C80-C82 C90-C92 C100 C101 C110-C114 C117: PackageReference: 0402; Value: 47nF
  C61 C74 C95: Value: 100uF
  C71-C73 C93: PackageReference: 0402; Value: 10nF
  C94: PackageReference: 0402; Value: 100nF
  C109: Value: 47nF
U3 = XC7A35T-1CSG324I: as U3 on sheet FPGA_Bank_0; DatasheetVersion: v1.15; PackageVersion: Rev. 1.11; PackageReference: CSG-324; PackageDescription: 324-Ball Wire-Bond Chip-Scale BGA, Body 15 x 15 mm, Pitch 0.8 mm; Maximum Distributed RAM: 400 Kb; Operating Temperature Range: Industrial; NexusDeviceID: XC7A35T-1CSG324I; Mounting Technology: Surface Mount; PartNumber: XC7A35T-1CSG324I; ComponentLink1Description: Manufacturer URL; ComponentLink1URL: http://www.xilinx.com/; ComponentLink2Description: Datasheet; ComponentLink2URL: http://www.xilinx.com/support/documentation/data_sheets/ds180_7Series_Overview.pdf; ComponentLink3Description: Package Specification; ComponentLink3URL: http://www.xilinx.com/support/documentation/user_guides/ug475_7Series_Pkg_Pinout.pdf; ComponentLink4Description: DC and Switching Characteristics; ComponentLink4URL: http://www.xilinx.com/support/documentation/data_sheets/ds181_Artix_7_Data_Sheet.pdf; ComponentLink5Description: Package File; ComponentLink5URL: http://www.xilinx.com/support/packagefiles/a7packages/xc7a200tsbg484pkg.txt; ComponentLink6Description: Packaging and Pinout; ComponentLink6URL: http://www.xilinx.com/support/documentation/user_guides/ug475_7Series_Pkg_Pinout.pdf

## Sheet FPGA_10_100 Ethernet PHY.SchDoc
size A4
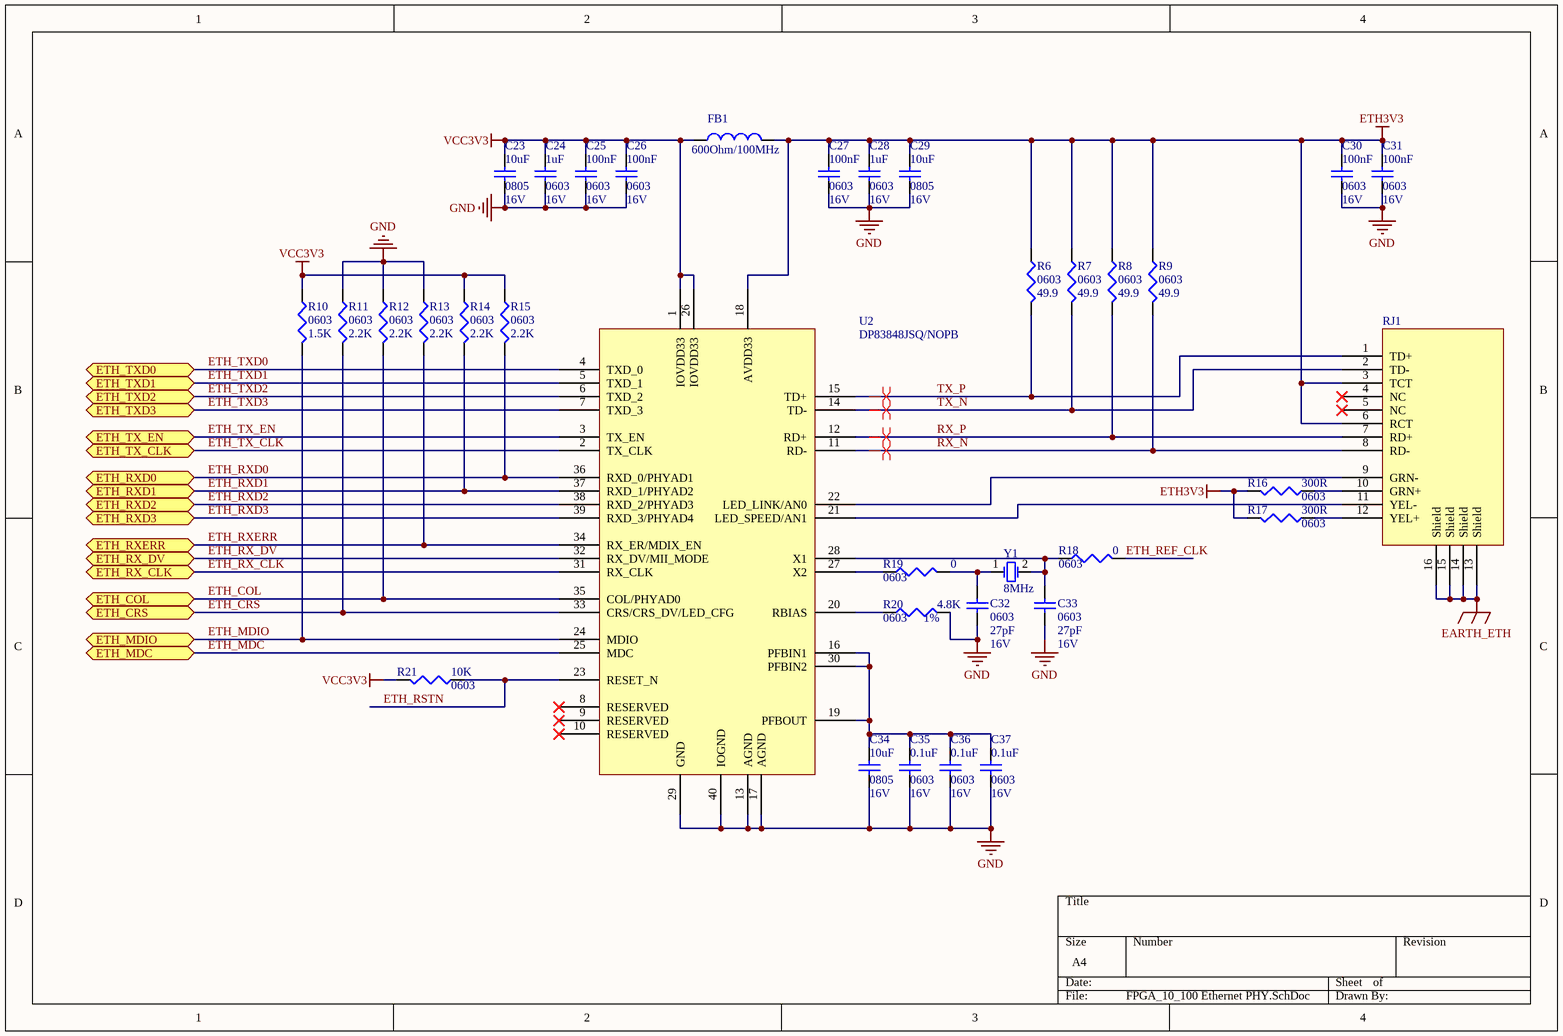
[diagram p4: FPGA_10_100 Ethernet PHY.SchDoc]

### Parts
C23  PackageReference: 0805  V: 16V  [2012[0805]]  (hidden comment: 10uF)
C24  PackageReference: 0603  V: 16V  [1608[0603]]  (hidden comment: 1uF)
C25  PackageReference: 0603  V: 16V  [1608[0603]]  (hidden comment: 100nF)
C26  PackageReference: 0603  V: 16V  [1608[0603]]  (hidden comment: 100nF)
C27  PackageReference: 0603  V: 16V  [1608[0603]]  (hidden comment: 100nF)
C28  PackageReference: 0603  V: 16V  [1608[0603]]  (hidden comment: 1uF)
C29  PackageReference: 0805  V: 16V  [2012[0805]]  (hidden comment: 10uF)
C30  PackageReference: 0603  V: 16V  [1608[0603]]  (hidden comment: 100nF)
C31  PackageReference: 0603  V: 16V  [1608[0603]]  (hidden comment: 100nF)
C32  PackageReference: 0603  V: 16V  [1608[0603]]  (hidden comment: 27pF)
C33  PackageReference: 0603  V: 16V  [1608[0603]]  (hidden comment: 27pF)
C34  PackageReference: 0805  V: 16V  [2012[0805]]  (hidden comment: 10uF)
C35  PackageReference: 0603  V: 16V  [1608[0603]]  (hidden comment: 0.1uF)
C36  PackageReference: 0603  V: 16V  [1608[0603]]  (hidden comment: 0.1uF)
C37  PackageReference: 0603  V: 16V  [1608[0603]]  (hidden comment: 0.1uF)
FB1  600Ohm/100MHz  [2012[0805]]
R6  value 49.9  PackageReference: 0603  [1608[0603]]  (hidden comment: Res3)
R7  value 49.9  PackageReference: 0603  [1608[0603]]  (hidden comment: Res3)
R8  value 49.9  PackageReference: 0603  [1608[0603]]  (hidden comment: Res3)
R9  value 49.9  PackageReference: 0603  [1608[0603]]  (hidden comment: Res3)
R10  value 1.5K  PackageReference: 0603  [1608[0603]]  (hidden comment: Res3)
R11  value 2.2K  PackageReference: 0603  [1608[0603]]  (hidden comment: Res3)
R12  value 2.2K  PackageReference: 0603  [1608[0603]]  (hidden comment: Res3)
R13  value 2.2K  PackageReference: 0603  [1608[0603]]  (hidden comment: Res3)
R14  value 2.2K  PackageReference: 0603  [1608[0603]]  (hidden comment: Res3)
R15  value 2.2K  PackageReference: 0603  [1608[0603]]  (hidden comment: Res3)
R16  value 300R  PackageReference: 0603  [1608[0603]]  (hidden comment: Res3)
R17  value 300R  PackageReference: 0603  [1608[0603]]  (hidden comment: Res3)
R18  value 0  PackageReference: 0603  [1608[0603]]  (hidden comment: Res3)
R19  value 0  PackageReference: 0603  [1608[0603]]  (hidden comment: Res3)
R20  value 4.8K  PackageReference: 0603  AC: 1%  [1608[0603]]  (hidden comment: Res3)
R21  value 10K  PackageReference: 0603  [1608[0603]]  (hidden comment: Res3)
RJ1  RJ45  [RJ45-1]  (value not drawn)
U2  DP83848JSQ/NOPB  [DP83848J]
Y1  8MHz  [XTAL_A]

### Ports
ETH_COL, ETH_CRS, ETH_MDC, ETH_MDIO, ETH_RX_CLK, ETH_RX_DV, ETH_RXD0, ETH_RXD1, ETH_RXD2, ETH_RXD3, ETH_RXERR, ETH_TX_CLK, ETH_TX_EN, ETH_TXD0, ETH_TXD1, ETH_TXD2, ETH_TXD3

### Nets
EARTH_ETH: RJ1.13(Shield) RJ1.14(Shield) RJ1.15(Shield) RJ1.16(Shield)
ETH3V3: C27.1 C28.1 C29.1 C30.1 C31.1 FB1.2 R6.1 R7.1 R8.1 R9.1 R16.2 R17.2 RJ1.3(TCT) RJ1.6(RCT) U2.18(AVDD33)
GND: C23.2 C24.2 C25.2 C26.2 C27.2 C28.2 C29.2 C30.2 C31.2 C32.2 C33.2 C34.2 C35.2 C36.2 C37.2 R11.1 R12.1 R13.1 R20.2 U2.13(AGND) U2.17(AGND) U2.29(GND) U2.40(IOGND)
VCC3V3: C23.1 C24.1 C25.1 C26.1 FB1.1 R10.1 R14.1 R15.1 R21.2 U2.1(IOVDD33) U2.26(IOVDD33)
ETH_COL: R12.2 U2.35(COL/PHYAD0) ; port ETH_COL
ETH_CRS: R11.2 U2.33(CRS/CRS_DV/LED_CFG) ; port ETH_CRS
ETH_MDC: U2.25(MDC) ; port ETH_MDC
ETH_MDIO: R10.2 U2.24(MDIO) ; port ETH_MDIO
ETH_REF_CLK: R18.2
ETH_RSTN: R21.1 U2.23(RESET_N)
ETH_RX_CLK: U2.31(RX_CLK) ; port ETH_RX_CLK
ETH_RX_DV: U2.32(RX_DV/MII_MODE) ; port ETH_RX_DV
ETH_RXD0: R15.2 U2.36(RXD_0/PHYAD1) ; port ETH_RXD0
ETH_RXD1: R14.2 U2.37(RXD_1/PHYAD2) ; port ETH_RXD1
ETH_RXD2: U2.38(RXD_2/PHYAD3) ; port ETH_RXD2
ETH_RXD3: U2.39(RXD_3/PHYAD4) ; port ETH_RXD3
ETH_RXERR: R13.2 U2.34(RX_ER/MDIX_EN) ; port ETH_RXERR
ETH_TX_CLK: U2.2(TX_CLK) ; port ETH_TX_CLK
ETH_TX_EN: U2.3(TX_EN) ; port ETH_TX_EN
ETH_TXD0: U2.4(TXD_0) ; port ETH_TXD0
ETH_TXD1: U2.5(TXD_1) ; port ETH_TXD1
ETH_TXD2: U2.6(TXD_2) ; port ETH_TXD2
ETH_TXD3: U2.7(TXD_3) ; port ETH_TXD3
RX_N: R9.2 RJ1.8(RD-) U2.11(RD-)
RX_P: R8.2 RJ1.7(RD+) U2.12(RD+)
TX_N: R7.2 RJ1.2(TD-) U2.14(TD-)
TX_P: R6.2 RJ1.1(TD+) U2.15(TD+)
NetC32_1: C32.1 R19.2 Y1.1(OSC1)
NetC33_1: C33.1 R18.1 U2.28(X1) Y1.2(OSC2)
NetC34_1: C34.1 C35.1 C36.1 C37.1 U2.16(PFBIN1) U2.19(PFBOUT) U2.30(PFBIN2)
NetR16_1: R16.1 RJ1.10(GRN+)
NetR17_1: R17.1 RJ1.12(YEL+)
NetR19_1: R19.1 U2.27(X2)
NetR20_1: R20.1 U2.20(RBIAS)
NetRJ1_9: RJ1.9(GRN-) U2.22(LED_LINK/AN0)
NetRJ1_11: RJ1.11(YEL-) U2.21(LED_SPEED/AN1)

Not connected (* = marked no-connect by the designer): RJ1 4(NC)* 5(NC)*; U2 8(RESERVED)* 9(RESERVED)* 10(RESERVED)*

### Layout directives
differential pair: RX_N, RX_P, TX_N, TX_P

### Library data of the parts
C23-C37 = Cap Semi: Capacitor (Semiconductor SIM Model); LatestRevisionDate: 17-Jul-2002; LatestRevisionNote: Re-released for DXP Platform.; Publisher: Altium Limited
  C23 C29 C34: Value: 10uF
  C24 C28: Value: 1uF
  C25-C27 C30 C31: Value: 100nF
  C32 C33: Value: 27pF
  C35-C37: Value: 0.1uF
FB1 = Inductor: Value: 600Ohm/100MHz
R6-R21 = Res3: Resistor; Published: 8-Jun-2000; LatestRevisionDate: 29-May-2009; LatestRevisionNote: IPC-7351 Footprint Added.; Publisher: Altium Limited; PackageDescription: Chip Resistor
RJ1 = RJ45: 网口座
Y1 = XTAL: Crystal Oscillator; Published: 8-Jun-2000; LatestRevisionDate: 17-Jul-2002; LatestRevisionNote: Re-released for DXP Platform.; PackageReference: R38; Publisher: Altium Limited; Value: 8MHz

## Sheet DDR3.SchDoc
size A4
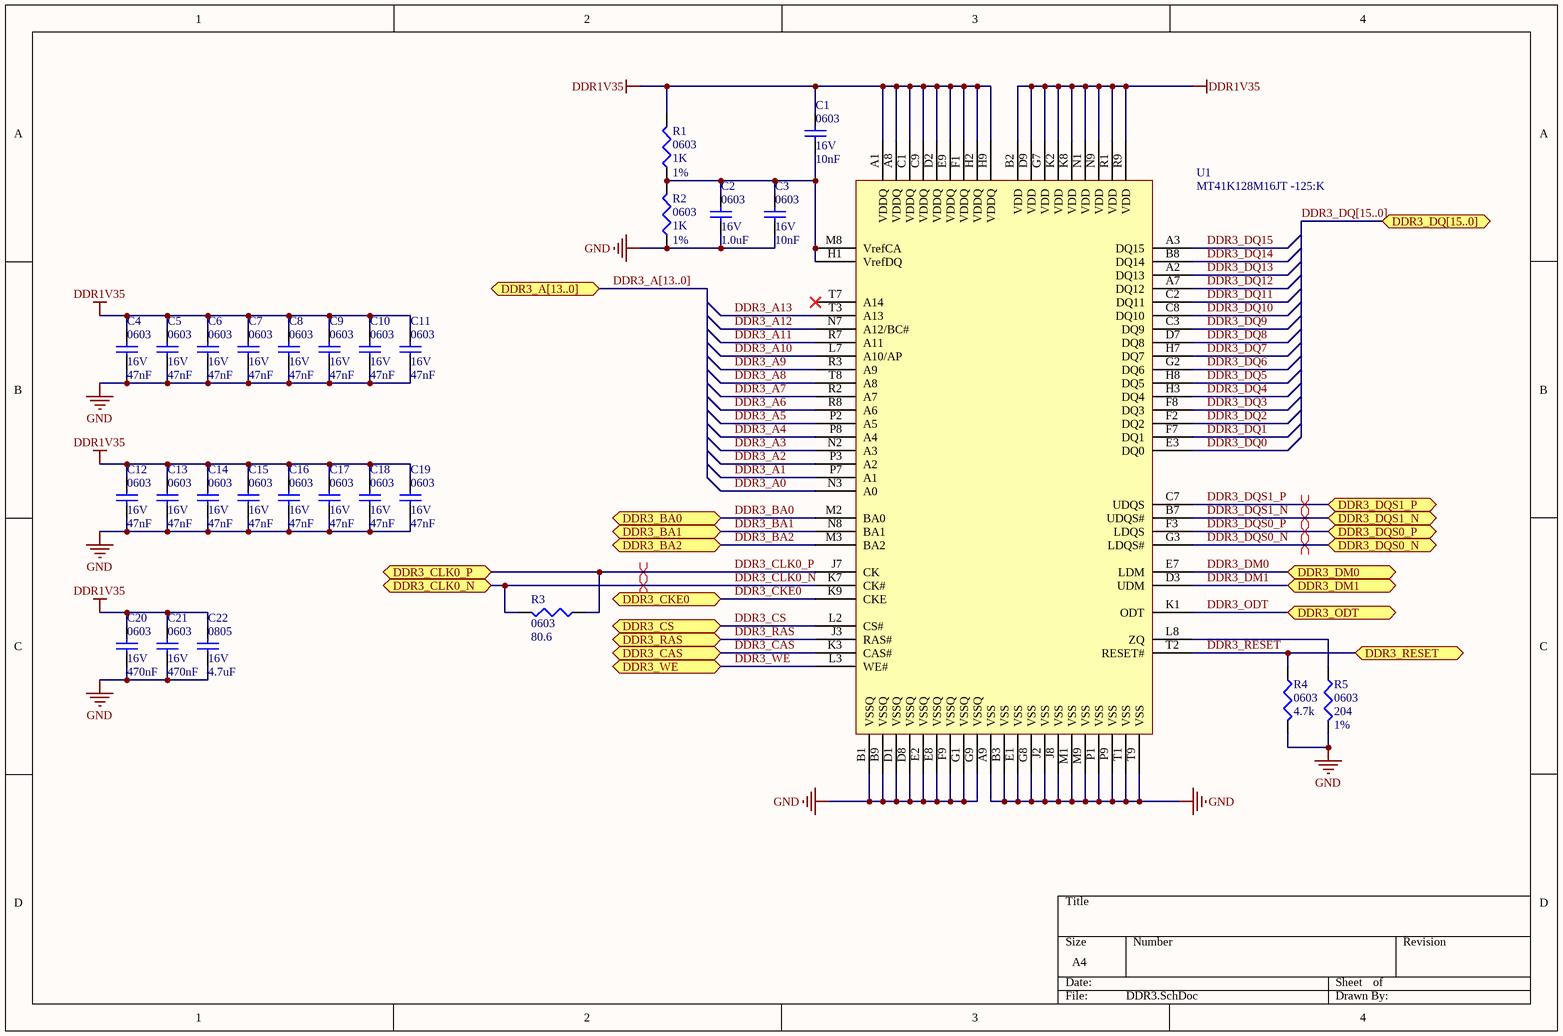
[diagram p5: DDR3.SchDoc]

### Parts
C1  PackageReference: 0603  V: 16V  [1608[0603]]  (hidden comment: 10nF)
C2  PackageReference: 0603  V: 16V  [1608[0603]]  (hidden comment: 1.0uF)
C3  PackageReference: 0603  V: 16V  [1608[0603]]  (hidden comment: 10nF)
C4  PackageReference: 0603  V: 16V  [1608[0603]]  (hidden comment: 47nF)
C5  PackageReference: 0603  V: 16V  [1608[0603]]  (hidden comment: 47nF)
C6  PackageReference: 0603  V: 16V  [1608[0603]]  (hidden comment: 47nF)
C7  PackageReference: 0603  V: 16V  [1608[0603]]  (hidden comment: 47nF)
C8  PackageReference: 0603  V: 16V  [1608[0603]]  (hidden comment: 47nF)
C9  PackageReference: 0603  V: 16V  [1608[0603]]  (hidden comment: 47nF)
C10  PackageReference: 0603  V: 16V  [1608[0603]]  (hidden comment: 47nF)
C11  PackageReference: 0603  V: 16V  [1608[0603]]  (hidden comment: 47nF)
C12  PackageReference: 0603  V: 16V  [1608[0603]]  (hidden comment: 47nF)
C13  PackageReference: 0603  V: 16V  [1608[0603]]  (hidden comment: 47nF)
C14  PackageReference: 0603  V: 16V  [1608[0603]]  (hidden comment: 47nF)
C15  PackageReference: 0603  V: 16V  [1608[0603]]  (hidden comment: 47nF)
C16  PackageReference: 0603  V: 16V  [1608[0603]]  (hidden comment: 47nF)
C17  PackageReference: 0603  V: 16V  [1608[0603]]  (hidden comment: 47nF)
C18  PackageReference: 0603  V: 16V  [1608[0603]]  (hidden comment: 47nF)
C19  PackageReference: 0603  V: 16V  [1608[0603]]  (hidden comment: 47nF)
C20  PackageReference: 0603  V: 16V  [1608[0603]]  (hidden comment: 470nF)
C21  PackageReference: 0603  V: 16V  [1608[0603]]  (hidden comment: 470nF)
C22  PackageReference: 0805  V: 16V  [2012[0805]]  (hidden comment: 4.7uF)
R1  value 1K  PackageReference: 0603  accuracy: 1%  [1608[0603]]  (hidden comment: Res3)
R2  value 1K  PackageReference: 0603  accuracy: 1%  [1608[0603]]  (hidden comment: Res3)
R3  value 80.6  PackageReference: 0603  [1608[0603]]  (hidden comment: Res3)
R4  value 4.7k  PackageReference: 0603  [1608[0603]]  (hidden comment: Res3)
R5  value 204  PackageReference: 0603  accuracy: 1%  [1608[0603]]  (hidden comment: Res3)
U1  MT41K128M16JT -125:K  [MT41K128M16JT]

### Ports
DDR3_A[13..0], DDR3_BA0, DDR3_BA1, DDR3_BA2, DDR3_CAS, DDR3_CKE0, DDR3_CLK0_N, DDR3_CLK0_P, DDR3_CS, DDR3_DM0, DDR3_DM1, DDR3_DQ[15..0], DDR3_DQS0_N, DDR3_DQS0_P, DDR3_DQS1_N, DDR3_DQS1_P, DDR3_ODT, DDR3_RAS, DDR3_RESET, DDR3_WE

### Nets
DDR1V35: C1.1 C4.1 C5.1 C6.1 C7.1 C8.1 C9.1 C10.1 C11.1 C12.1 C13.1 C14.1 C15.1 C16.1 C17.1 C18.1 C19.1 C20.1 C21.1 C22.1 R1.2 U1.A1(VDDQ) U1.A8(VDDQ) U1.B2(VDD) U1.C1(VDDQ) U1.C9(VDDQ) U1.D2(VDDQ) U1.D9(VDD) U1.E9(VDDQ) U1.F1(VDDQ) U1.G7(VDD) U1.H2(VDDQ) U1.H9(VDDQ) U1.K2(VDD) U1.K8(VDD) U1.N1(VDD) U1.N9(VDD) U1.R1(VDD) U1.R9(VDD)
GND: C2.2 C3.2 C4.2 C5.2 C6.2 C7.2 C8.2 C9.2 C10.2 C11.2 C12.2 C13.2 C14.2 C15.2 C16.2 C17.2 C18.2 C19.2 C20.2 C21.2 C22.2 R2.1 R4.2 R5.2 U1.A9(VSS) U1.B1(VSSQ) U1.B3(VSS) U1.B9(VSSQ) U1.D1(VSSQ) U1.D8(VSSQ) U1.E1(VSS) U1.E2(VSSQ) U1.E8(VSSQ) U1.F9(VSSQ) U1.G1(VSSQ) U1.G8(VSS) U1.G9(VSSQ) U1.J2(VSS) U1.J8(VSS) U1.M1(VSS) U1.M9(VSS) U1.P1(VSS) U1.P9(VSS) U1.T1(VSS) U1.T9(VSS)
DDR3_A0: U1.N3(A0)
DDR3_A1: U1.P7(A1)
DDR3_A2: U1.P3(A2)
DDR3_A3: U1.N2(A3)
DDR3_A4: U1.P8(A4)
DDR3_A5: U1.P2(A5)
DDR3_A6: U1.R8(A6)
DDR3_A7: U1.R2(A7)
DDR3_A8: U1.T8(A8)
DDR3_A9: U1.R3(A9)
DDR3_A10: U1.L7(A10/AP)
DDR3_A11: U1.R7(A11)
DDR3_A12: U1.N7(A12/BC#)
DDR3_A13: U1.T3(A13)
DDR3_BA0: U1.M2(BA0) ; port DDR3_BA0
DDR3_BA1: U1.N8(BA1) ; port DDR3_BA1
DDR3_BA2: U1.M3(BA2) ; port DDR3_BA2
DDR3_CAS: U1.K3(CAS#) ; port DDR3_CAS
DDR3_CKE0: U1.K9(CKE) ; port DDR3_CKE0
DDR3_CLK0_N: R3.2 U1.K7(CK#) ; port DDR3_CLK0_N
DDR3_CLK0_P: R3.1 U1.J7(CK) ; port DDR3_CLK0_P
DDR3_CS: U1.L2(CS#) ; port DDR3_CS
DDR3_DM0: U1.E7(LDM) ; port DDR3_DM0
DDR3_DM1: U1.D3(UDM) ; port DDR3_DM1
DDR3_DQ0: U1.E3(DQ0)
DDR3_DQ1: U1.F7(DQ1)
DDR3_DQ2: U1.F2(DQ2)
DDR3_DQ3: U1.F8(DQ3)
DDR3_DQ4: U1.H3(DQ4)
DDR3_DQ5: U1.H8(DQ5)
DDR3_DQ6: U1.G2(DQ6)
DDR3_DQ7: U1.H7(DQ7)
DDR3_DQ8: U1.D7(DQ8)
DDR3_DQ9: U1.C3(DQ9)
DDR3_DQ10: U1.C8(DQ10)
DDR3_DQ11: U1.C2(DQ11)
DDR3_DQ12: U1.A7(DQ12)
DDR3_DQ13: U1.A2(DQ13)
DDR3_DQ14: U1.B8(DQ14)
DDR3_DQ15: U1.A3(DQ15)
DDR3_DQS0_N: U1.G3(LDQS#) ; port DDR3_DQS0_N
DDR3_DQS0_P: U1.F3(LDQS) ; port DDR3_DQS0_P
DDR3_DQS1_N: U1.B7(UDQS#) ; port DDR3_DQS1_N
DDR3_DQS1_P: U1.C7(UDQS) ; port DDR3_DQS1_P
DDR3_ODT: U1.K1(ODT) ; port DDR3_ODT
DDR3_RAS: U1.J3(RAS#) ; port DDR3_RAS
DDR3_RESET: R4.1 U1.T2(RESET#) ; port DDR3_RESET
DDR3_WE: U1.L3(WE#) ; port DDR3_WE
NetC1_2: C1.2 C2.1 C3.1 R1.1 R2.2 U1.H1(VrefDQ) U1.M8(VrefCA)
NetR5_1: R5.1 U1.L8(ZQ)

Not connected (* = marked no-connect by the designer): U1 T7(A14)*

### Buses and harness runs
bus DDR3_A[13..0] = port DDR3_A[13..0]
bus DDR3_DQ[15..0] = port DDR3_DQ[15..0]

### Layout directives
differential pair: DDR3_CLK0_N, DDR3_CLK0_P, DDR3_DQS0_N, DDR3_DQS0_P, DDR3_DQS1_N, DDR3_DQS1_P

### Library data of the parts
C1-C22 = Cap Semi: Capacitor (Semiconductor SIM Model); LatestRevisionDate: 17-Jul-2002; LatestRevisionNote: Re-released for DXP Platform.; Publisher: Altium Limited
  C1 C3: Value: 10nF
  C2: Value: 1.0uF
  C4-C19: Value: 47nF
  C20 C21: Value: 470nF
  C22: Value: 4.7uF
R1 R2 R5 = Res3: Resistor; Published: 8-Jun-2000; LatestRevisionDate: 29-May-2009; LatestRevisionNote: IPC-7351 Footprint Added.; Publisher: Altium Limited; PackageDescription: Chip Resistor
R3 R4 = Res3: Resistor; accuracy: 1%; Published: 8-Jun-2000; LatestRevisionDate: 29-May-2009; LatestRevisionNote: IPC-7351 Footprint Added.; Publisher: Altium Limited; PackageDescription: Chip Resistor
U1 = MT41K128M16JT -125:K: DDR3L

## Sheet USB3.0.SchDoc
size A3
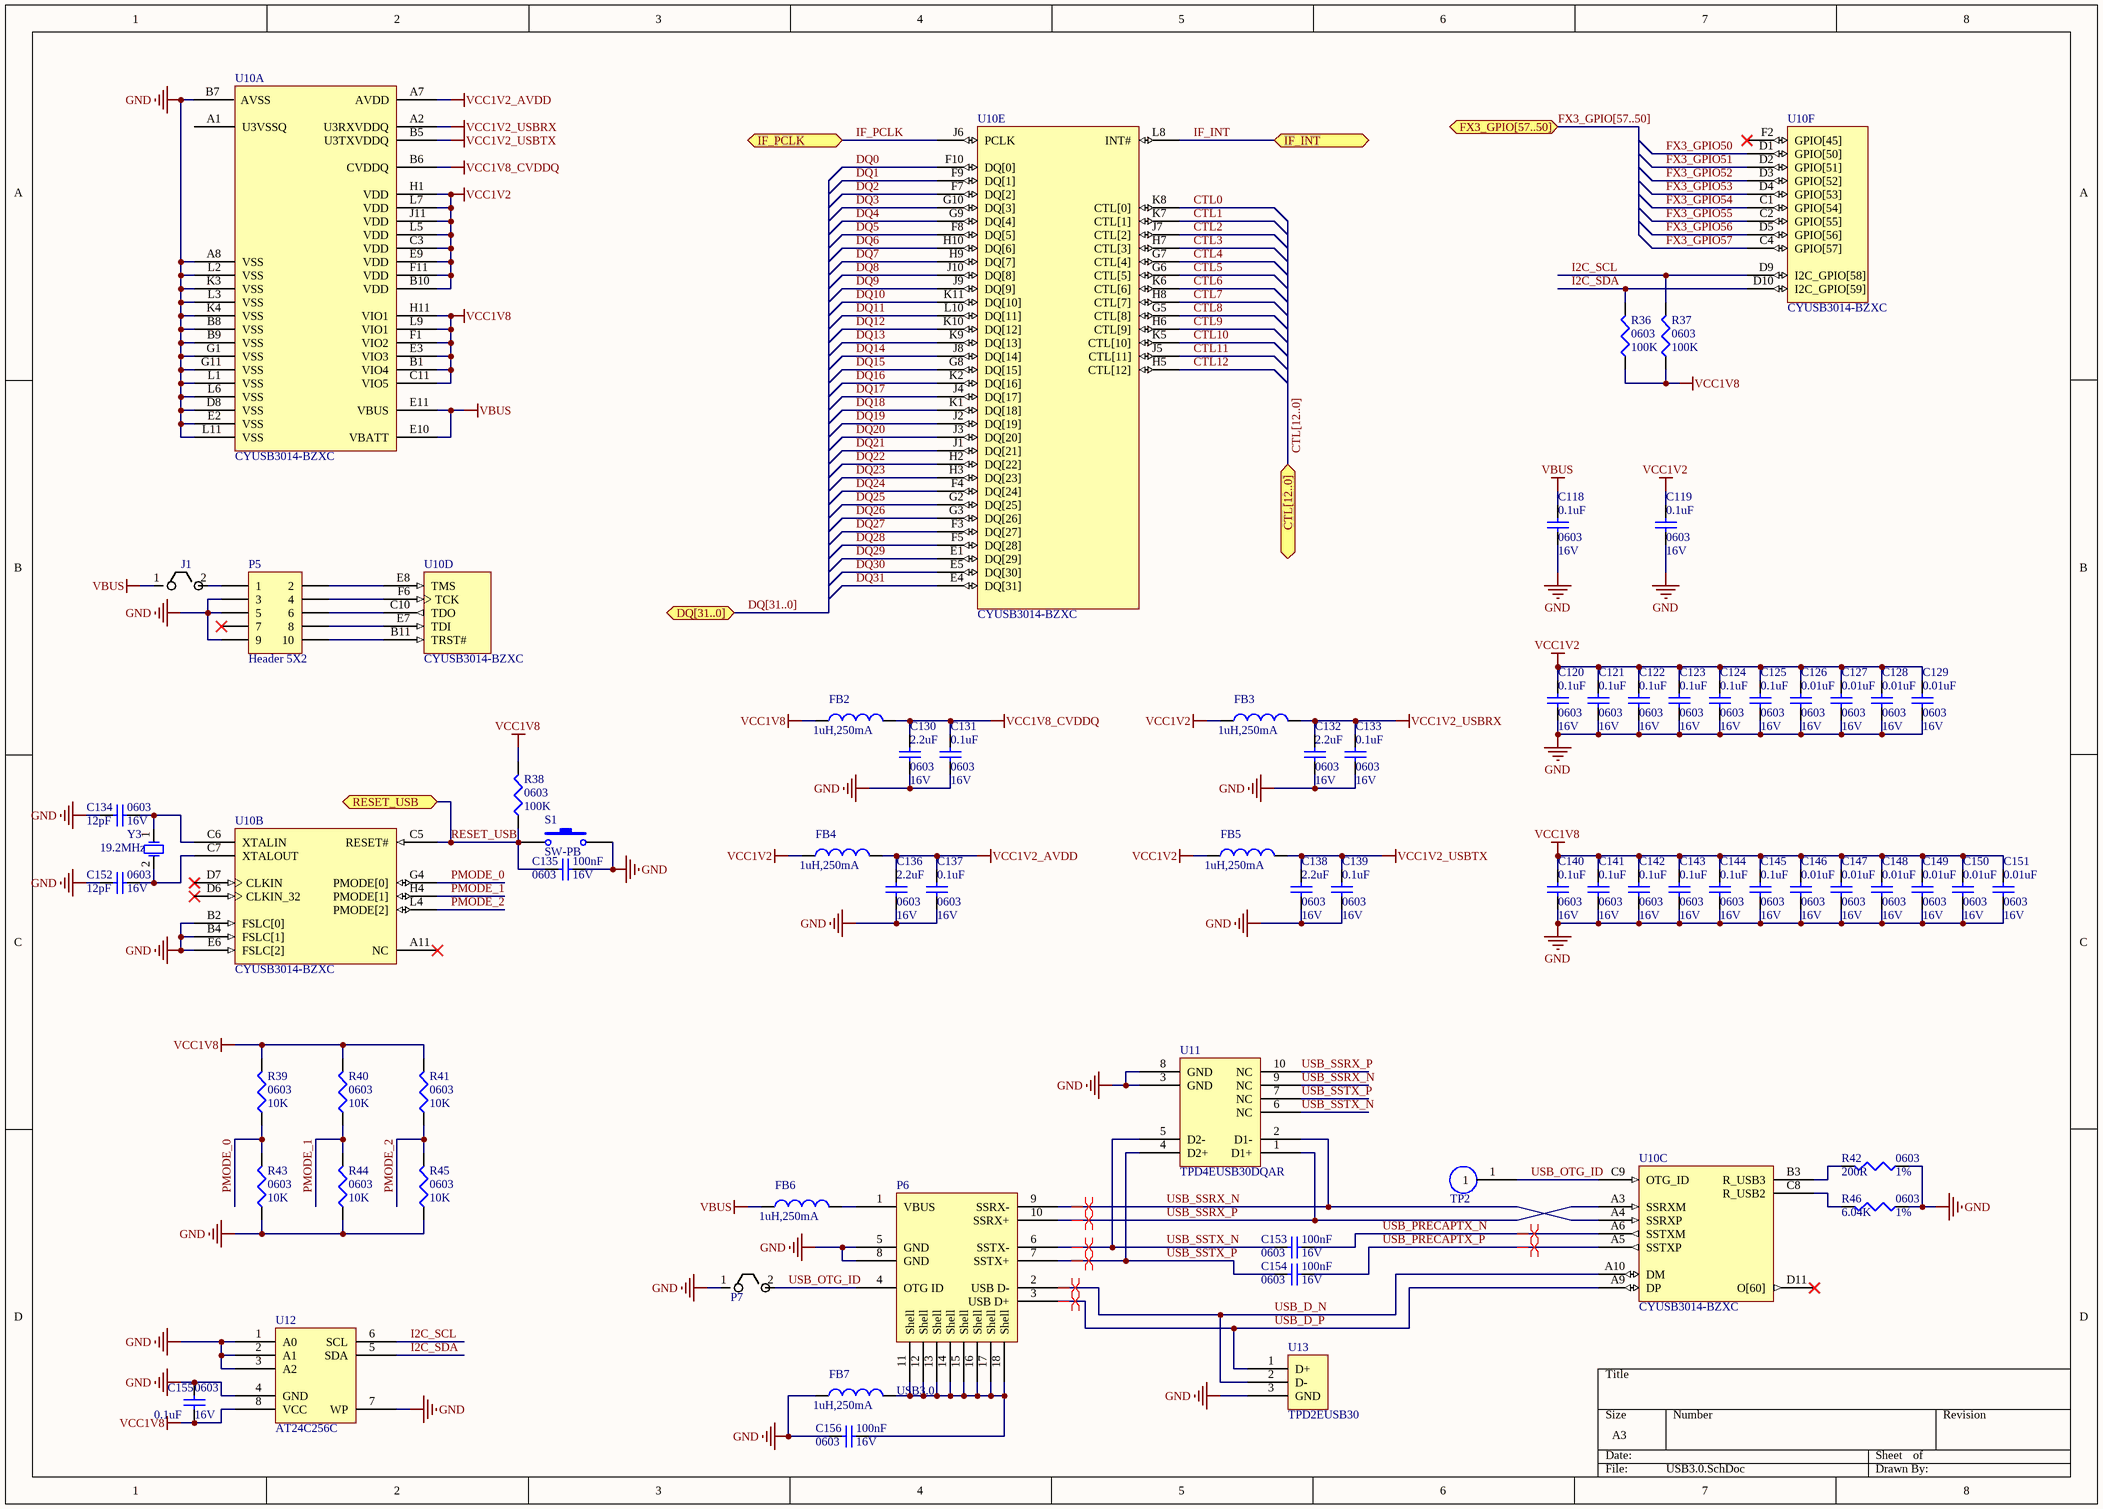
[diagram p6: USB3.0.SchDoc]

### Parts
C118  PackageReference: 0603  V: 16V  [1608[0603]]  (hidden comment: 0.1uF)
C119  PackageReference: 0603  V: 16V  [1608[0603]]  (hidden comment: 0.1uF)
C120  PackageReference: 0603  V: 16V  [1608[0603]]  (hidden comment: 0.1uF)
C121  PackageReference: 0603  V: 16V  [1608[0603]]  (hidden comment: 0.1uF)
C122  PackageReference: 0603  V: 16V  [1608[0603]]  (hidden comment: 0.1uF)
C123  PackageReference: 0603  V: 16V  [1608[0603]]  (hidden comment: 0.1uF)
C124  PackageReference: 0603  V: 16V  [1608[0603]]  (hidden comment: 0.1uF)
C125  PackageReference: 0603  V: 16V  [1608[0603]]  (hidden comment: 0.1uF)
C126  PackageReference: 0603  V: 16V  [1608[0603]]  (hidden comment: 0.01uF)
C127  PackageReference: 0603  V: 16V  [1608[0603]]  (hidden comment: 0.01uF)
C128  PackageReference: 0603  V: 16V  [1608[0603]]  (hidden comment: 0.01uF)
C129  PackageReference: 0603  V: 16V  [1608[0603]]  (hidden comment: 0.01uF)
C130  PackageReference: 0603  V: 16V  [1608[0603]]  (hidden comment: 2.2uF)
C131  PackageReference: 0603  V: 16V  [1608[0603]]  (hidden comment: 0.1uF)
C132  PackageReference: 0603  V: 16V  [1608[0603]]  (hidden comment: 2.2uF)
C133  PackageReference: 0603  V: 16V  [1608[0603]]  (hidden comment: 0.1uF)
C134  PackageReference: 0603  V: 16V  [1608[0603]]  (hidden comment: 12pF)
C135  PackageReference: 0603  V: 16V  [1608[0603]]  (hidden comment: 100nF)
C136  PackageReference: 0603  V: 16V  [1608[0603]]  (hidden comment: 2.2uF)
C137  PackageReference: 0603  V: 16V  [1608[0603]]  (hidden comment: 0.1uF)
C138  PackageReference: 0603  V: 16V  [1608[0603]]  (hidden comment: 2.2uF)
C139  PackageReference: 0603  V: 16V  [1608[0603]]  (hidden comment: 0.1uF)
C140  PackageReference: 0603  V: 16V  [1608[0603]]  (hidden comment: 0.1uF)
C141  PackageReference: 0603  V: 16V  [1608[0603]]  (hidden comment: 0.1uF)
C142  PackageReference: 0603  V: 16V  [1608[0603]]  (hidden comment: 0.1uF)
C143  PackageReference: 0603  V: 16V  [1608[0603]]  (hidden comment: 0.1uF)
C144  PackageReference: 0603  V: 16V  [1608[0603]]  (hidden comment: 0.1uF)
C145  PackageReference: 0603  V: 16V  [1608[0603]]  (hidden comment: 0.1uF)
C146  PackageReference: 0603  V: 16V  [1608[0603]]  (hidden comment: 0.01uF)
C147  PackageReference: 0603  V: 16V  [1608[0603]]  (hidden comment: 0.01uF)
C148  PackageReference: 0603  V: 16V  [1608[0603]]  (hidden comment: 0.01uF)
C149  PackageReference: 0603  V: 16V  [1608[0603]]  (hidden comment: 0.01uF)
C150  PackageReference: 0603  V: 16V  [1608[0603]]  (hidden comment: 0.01uF)
C151  PackageReference: 0603  V: 16V  [1608[0603]]  (hidden comment: 0.01uF)
C152  PackageReference: 0603  V: 16V  [1608[0603]]  (hidden comment: 12pF)
C153  PackageReference: 0603  V: 16V  [1608[0603]]  (hidden comment: 100nF)
C154  PackageReference: 0603  V: 16V  [1608[0603]]  (hidden comment: 100nF)
C155  PackageReference: 0603  V: 16V  [1608[0603]]  (hidden comment: 0.1uF)
C156  PackageReference: 0603  V: 16V  [1608[0603]]  (hidden comment: 100nF)
FB2  1uH,250mA  [2012[0805]]
FB3  1uH,250mA  [2012[0805]]
FB4  1uH,250mA  [2012[0805]]
FB5  1uH,250mA  [2012[0805]]
FB6  1uH,250mA  [2012[0805]]
FB7  1uH,250mA  [2012[0805]]
J1  DNP  [DNP]  (value not drawn)
P5  Header 5X2  [HDR2X5]
P6  USB3.0  [ZX360D-B-10P]
P7  DNP  [DNP]  (value not drawn)
R36  value 100K  PackageReference: 0603  [1608[0603]]  (hidden comment: Res3)
R37  value 100K  PackageReference: 0603  [1608[0603]]  (hidden comment: Res3)
R38  value 100K  PackageReference: 0603  [1608[0603]]  (hidden comment: Res3)
R39  value 10K  PackageReference: 0603  [1608[0603]]  (hidden comment: Res3)
R40  value 10K  PackageReference: 0603  [1608[0603]]  (hidden comment: Res3)
R41  value 10K  PackageReference: 0603  [1608[0603]]  (hidden comment: Res3)
R42  value 200R  PackageReference: 0603  ac: 1%  [1608[0603]]  (hidden comment: Res3)
R43  value 10K  PackageReference: 0603  [1608[0603]]  (hidden comment: Res3)
R44  value 10K  PackageReference: 0603  [1608[0603]]  (hidden comment: Res3)
R45  value 10K  PackageReference: 0603  [1608[0603]]  (hidden comment: Res3)
R46  value 6.04K  PackageReference: 0603  ac: 1%  [1608[0603]]  (hidden comment: Res3)
S1  SW-PB  [SPST-2]
TP2  TP  (value not drawn)
U10  CYUSB3014-BZXC  [CYUSB3014]  (parts A,B,C,D,E,F of 6)
U11  TPD4EUSB30DQAR  [TPD4EUSB30]
U12  AT24C256C  [AT24C256C[SOP8]]
U13  TPD2EUSB30  [TPE2USB30]
Y3  19.2MHz  [XTAL_A]

### Ports
CTL[12..0], DQ[31..0], FX3_GPIO[57..50], IF_INT, IF_PCLK, RESET_USB

### Nets
GND: C118.2 C119.2 C120.2 C121.2 C122.2 C123.2 C124.2 C125.2 C126.2 C127.2 C128.2 C129.2 C130.2 C131.2 C132.2 C133.2 C134.2 C135.2 C136.2 C137.2 C138.2 C139.2 C140.2 C141.2 C142.2 C143.2 C144.2 C145.2 C146.2 C147.2 C148.2 C149.2 C150.2 C151.2 C152.2 C155.2 C156.1 FB7.1 P5.3 P5.5 P5.9 P6.5(GND) P6.8(GND) P7.1 R42.1 R43.1 R44.1 R45.1 R46.1 S1.2 U10.A8(VSS) U10.B2(FSLC[0]) U10.B4(FSLC[1]) U10.B7(AVSS) U10.B8(VSS) U10.B9(VSS) U10.D8(VSS) U10.E2(VSS) U10.E6(FSLC[2]) U10.G1(VSS) U10.G11(VSS) U10.K3(VSS) U10.K4(VSS) U10.L1(VSS) U10.L2(VSS) U10.L3(VSS) U10.L6(VSS) U10.L11(VSS) U11.3(GND) U11.8(GND) U12.1(A0) U12.2(A1) U12.3(A2) U12.4(GND) U12.7(WP) U13.3(GND)
VBUS: C118.1 FB6.1 J1.1 U10.E10(VBATT) U10.E11(VBUS)
VCC1V2: C119.1 C120.1 C121.1 C122.1 C123.1 C124.1 C125.1 C126.1 C127.1 C128.1 C129.1 FB3.1 FB4.1 FB5.1 U10.B10(VDD) U10.C3(VDD) U10.E9(VDD) U10.F11(VDD) U10.H1(VDD) U10.J11(VDD) U10.L5(VDD) U10.L7(VDD)
VCC1V2_AVDD: C136.1 C137.1 FB4.2 U10.A7(AVDD)
VCC1V2_USBRX: C132.1 C133.1 FB3.2 U10.A2(U3RXVDDQ)
VCC1V2_USBTX: C138.1 C139.1 FB5.2 U10.B5(U3TXVDDQ)
VCC1V8: C140.1 C141.1 C142.1 C143.1 C144.1 C145.1 C146.1 C147.1 C148.1 C149.1 C150.1 C151.1 C155.1 FB2.1 R36.1 R37.1 R38.2 R39.2 R40.2 R41.2 U10.B1(VIO4) U10.C11(VIO5) U10.E3(VIO3) U10.F1(VIO2) U10.H11(VIO1) U10.L9(VIO1) U12.8(VCC)
VCC1V8_CVDDQ: C130.1 C131.1 FB2.2 U10.B6(CVDDQ)
CTL0: U10.K8(CTL[0])
CTL1: U10.K7(CTL[1])
CTL2: U10.J7(CTL[2])
CTL3: U10.H7(CTL[3])
CTL4: U10.G7(CTL[4])
CTL5: U10.G6(CTL[5])
CTL6: U10.K6(CTL[6])
CTL7: U10.H8(CTL[7])
CTL8: U10.G5(CTL[8])
CTL9: U10.H6(CTL[9])
CTL10: U10.K5(CTL[10])
CTL11: U10.J5(CTL[11])
CTL12: U10.H5(CTL[12])
DQ0: U10.F10(DQ[0])
DQ1: U10.F9(DQ[1])
DQ2: U10.F7(DQ[2])
DQ3: U10.G10(DQ[3])
DQ4: U10.G9(DQ[4])
DQ5: U10.F8(DQ[5])
DQ6: U10.H10(DQ[6])
DQ7: U10.H9(DQ[7])
DQ8: U10.J10(DQ[8])
DQ9: U10.J9(DQ[9])
DQ10: U10.K11(DQ[10])
DQ11: U10.L10(DQ[11])
DQ12: U10.K10(DQ[12])
DQ13: U10.K9(DQ[13])
DQ14: U10.J8(DQ[14])
DQ15: U10.G8(DQ[15])
DQ16: U10.K2(DQ[16])
DQ17: U10.J4(DQ[17])
DQ18: U10.K1(DQ[18])
DQ19: U10.J2(DQ[19])
DQ20: U10.J3(DQ[20])
DQ21: U10.J1(DQ[21])
DQ22: U10.H2(DQ[22])
DQ23: U10.H3(DQ[23])
DQ24: U10.F4(DQ[24])
DQ25: U10.G2(DQ[25])
DQ26: U10.G3(DQ[26])
DQ27: U10.F3(DQ[27])
DQ28: U10.F5(DQ[28])
DQ29: U10.E1(DQ[29])
DQ30: U10.E5(DQ[30])
DQ31: U10.E4(DQ[31])
FX3_GPIO50: U10.D1(GPIO[50])
FX3_GPIO51: U10.D2(GPIO[51])
FX3_GPIO52: U10.D3(GPIO[52])
FX3_GPIO53: U10.D4(GPIO[53])
FX3_GPIO54: U10.C1(GPIO[54])
FX3_GPIO55: U10.C2(GPIO[55])
FX3_GPIO56: U10.D5(GPIO[56])
FX3_GPIO57: U10.C4(GPIO[57])
I2C_SCL: R37.2 U10.D9(I2C_GPIO[58]) U12.6(SCL)
I2C_SDA: R36.2 U10.D10(I2C_GPIO[59]) U12.5(SDA)
IF_INT: U10.L8(INT#) ; port IF_INT
IF_PCLK: U10.J6(PCLK) ; port IF_PCLK
PMODE_0: R39.1 R43.2 U10.G4(PMODE[0])
PMODE_1: R40.1 R44.2 U10.H4(PMODE[1])
PMODE_2: R41.1 R45.2 U10.L4(PMODE[2])
RESET_USB: C135.1 R38.1 S1.1 U10.C5(RESET#) ; port RESET_USB
USB_D_N: P6.2(USB_D-) U10.A10(DM) U13.2(D-)
USB_D_P: P6.3(USB_D+) U10.A9(DP) U13.1(D+)
USB_OTG_ID: P6.4(OTG_ID) P7.2 TP2.1 U10.C9(OTG_ID)
USB_PRECAPTX_N: C153.2 U10.A6(SSTXM)
USB_PRECAPTX_P: C154.2 U10.A5(SSTXP)
USB_SSRX_N: P6.9(SSRX-) U10.A4(SSRXP) U11.2(D1-) U11.9(NC)
USB_SSRX_P: P6.10(SSRX+) U10.A3(SSRXM) U11.1(D1+) U11.10(NC)
USB_SSTX_N: C153.1 P6.6(SSTX-) U11.5(D2-) U11.6(NC)
USB_SSTX_P: C154.1 P6.7(SSTX+) U11.4(D2+) U11.7(NC)
NetC134_1: C134.1 U10.C6(XTALIN) Y3.1(OSC1)
NetC152_1: C152.1 U10.C7(XTALOUT) Y3.2(OSC2)
NetC156_2: C156.2 FB7.2 P6.11(Shell) P6.12(Shell) P6.13(Shell) P6.14(Shell) P6.15(Shell) P6.16(Shell) P6.17(Shell) P6.18(Shell)
NetFB6_2: FB6.2 P6.1(VBUS)
NetJ1_2: J1.2 P5.1
NetP5_2: P5.2 U10.E8(TMS)
NetP5_4: P5.4 U10.F6(TCK)
NetP5_6: P5.6 U10.C10(TDO)
NetP5_8: P5.8 U10.E7(TDI)
NetP5_10: P5.10 U10.B11(TRST#)
NetR42_2: R42.2 U10.B3(R_USB3)
NetR46_2: R46.2 U10.C8(R_USB2)

Not connected (* = marked no-connect by the designer): P5 7*; U10 A1(U3VSSQ) A11(NC)* D6(CLKIN_32)* D7(CLKIN)* D11(O[60])* F2(GPIO[45])*

### Buses and harness runs
bus CTL[12..0] = port CTL[12..0]
bus DQ[31..0] = port DQ[31..0]
bus FX3_GPIO[57..50] = port FX3_GPIO[57..50]

### Layout directives
differential pair: USB_D_N, USB_D_P, USB_PRECAPTX_N, USB_PRECAPTX_P, USB_SSRX_N, USB_SSRX_P, USB_SSTX_N, USB_SSTX_P

### Library data of the parts
C118-C156 = Cap Semi: Capacitor (Semiconductor SIM Model); LatestRevisionDate: 17-Jul-2002; LatestRevisionNote: Re-released for DXP Platform.; Publisher: Altium Limited
  C118-C125 C131 C133 C137 C139-C145 C155: Value: 0.1uF
  C126-C129 C146-C151: Value: 0.01uF
  C130 C132 C136 C138: Value: 2.2uF
  C134 C152: Value: 12pF
  C135 C153 C154 C156: Value: 100nF
FB2-FB7 = Inductor: Value: 1uH,250mA
P5 = Header 5X2: Header, 5-Pin, Dual row; LatestRevisionDate: 17-Jul-2002; LatestRevisionNote: Re-released for DXP Platform.; Publisher: Altium Limited
R36-R46 = Res3: Resistor; Published: 8-Jun-2000; LatestRevisionDate: 29-May-2009; LatestRevisionNote: IPC-7351 Footprint Added.; Publisher: Altium Limited; PackageDescription: Chip Resistor
S1 = SW-PB: Switch; Published: 24-Mar-1999; LatestRevisionDate: 17-Jul-2002; LatestRevisionNote: Re-released for DXP Platform.; PackageReference: SPST-2; Publisher: Altium Limited
U11 = TPD4EUSB30DQAR: 4-Channel ESD Protection for Super-Speed USB 3.0 Interface
Y3 = XTAL: Crystal Oscillator; Published: 8-Jun-2000; LatestRevisionDate: 17-Jul-2002; LatestRevisionNote: Re-released for DXP Platform.; PackageReference: R38; Publisher: Altium Limited; Value: 19.2MHz